# EasyEDA Pro project Telemetrie v1.eprj

# Schematic Schematic1
Board Name: Telemetrie v1; Create Date: 2026-01-04; Page Name: P1; Project Name: Telemetrie v1; Schematic Name: Schematic1; Update Date: 2026-01-05; Company: EasyEDA.com; Page Size: A4; Version: V1.0
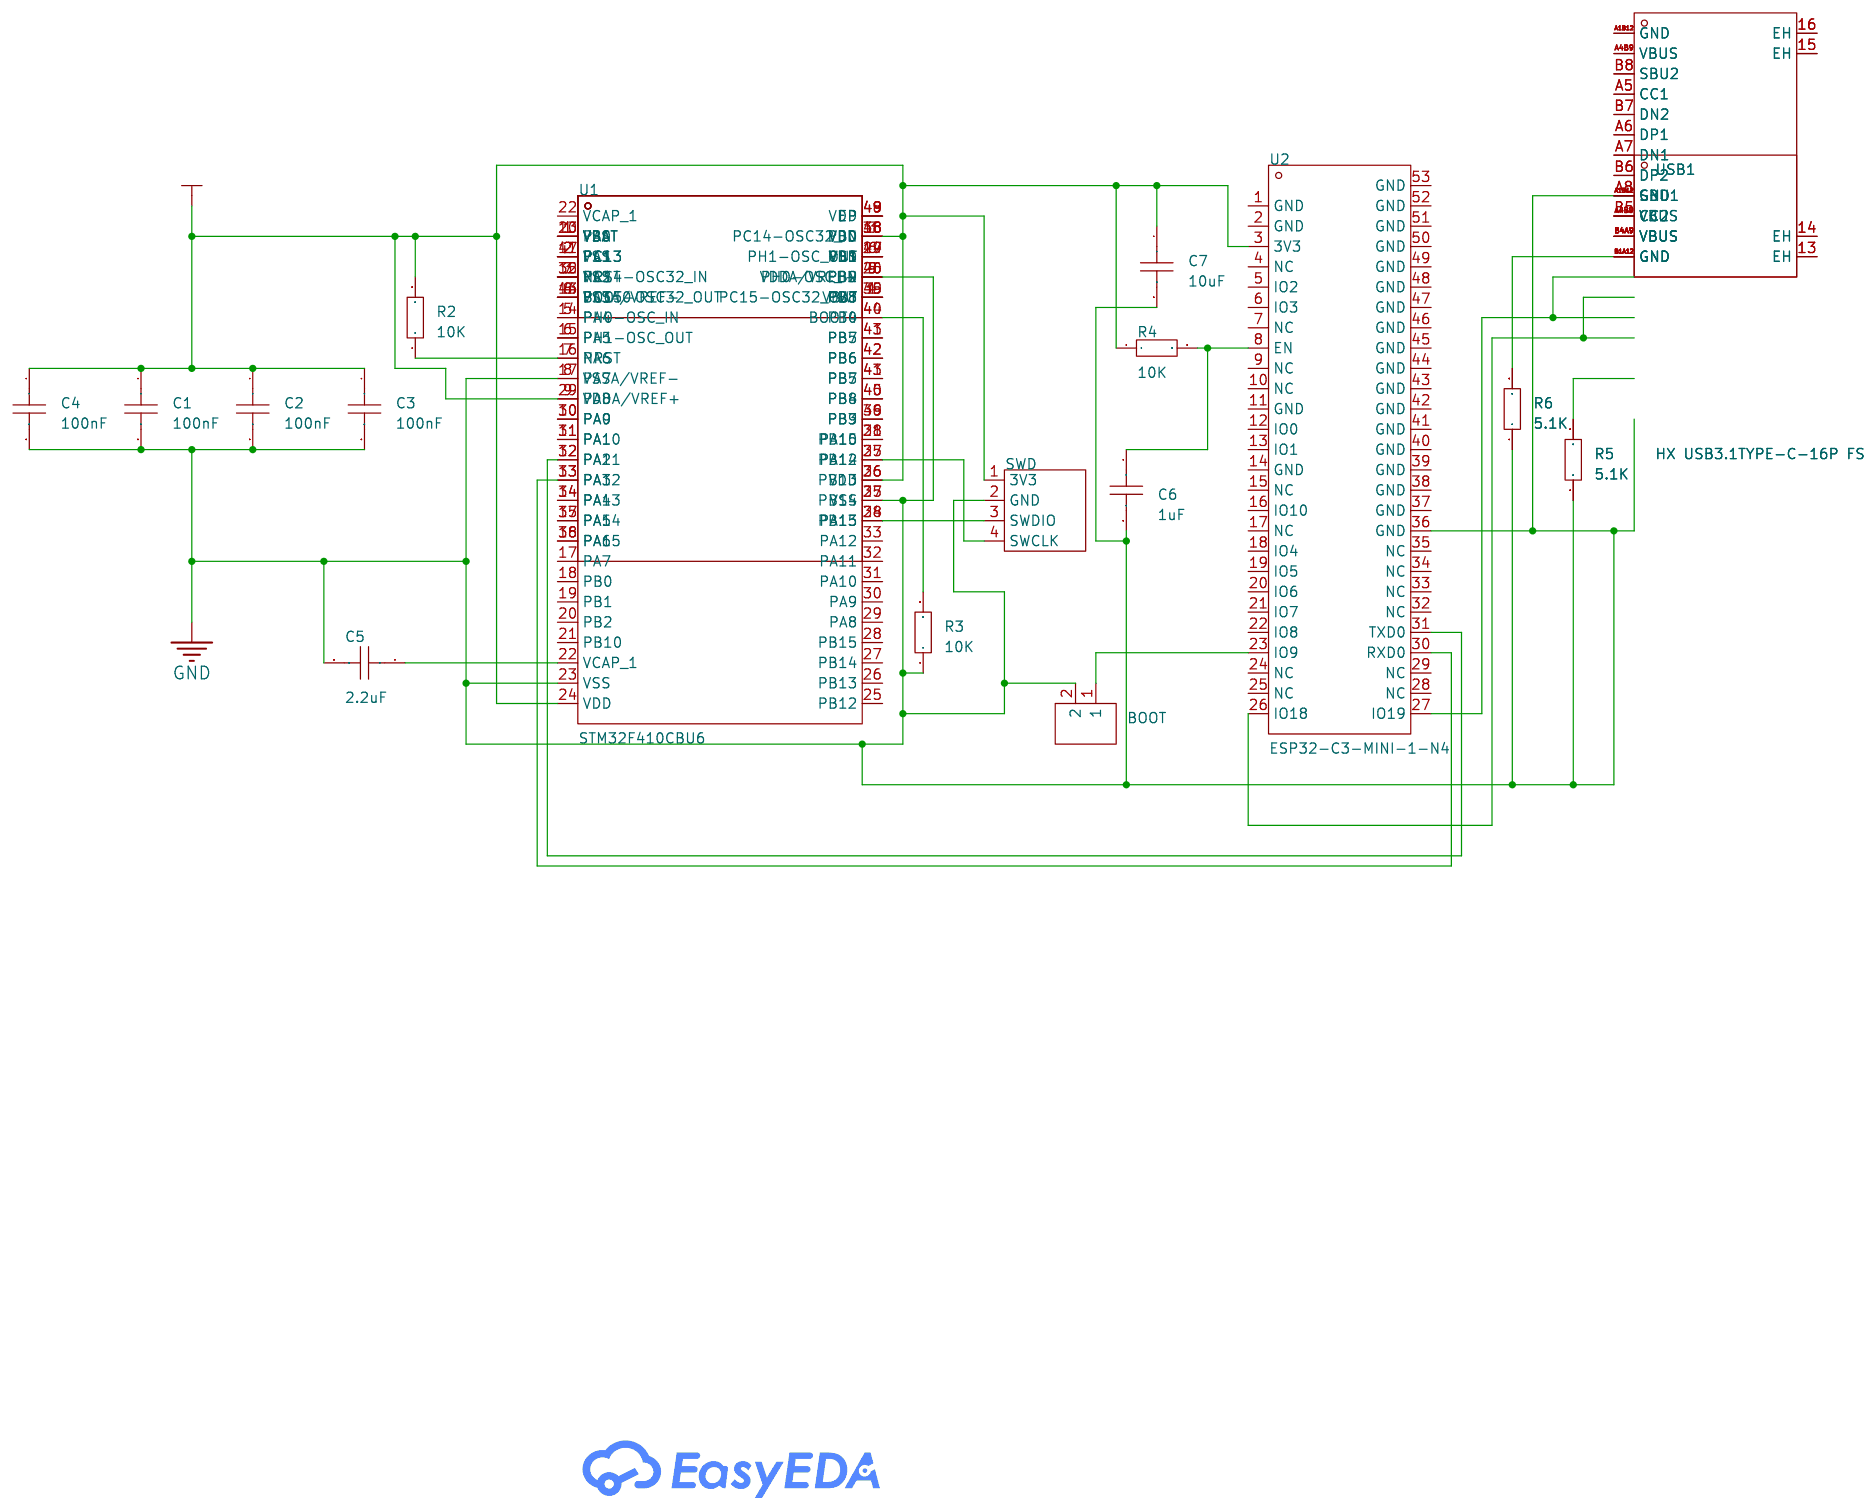
[diagram p0: schematic sheet]

## Parts
BOOT  PZ254V-11-02P  [HDR-TH_2P-P2.54-V-M]
C1  100nF  [C0603]
C2  100nF  [C0603]
C3  100nF  [C0603]
C4  100nF  [C0603]
C5  2.2uF  [C0603]
C6  1uF  [C0603]
C7  10uF  [C0603]
R2  10K  [R0603]
R3  10K  [R0603]
R4  10K  [R0603]
R5  5.1K  [R0603]
R6  5.1K  [R0603]
SWD  SWD  [HDR-TH_4P-HX-PH254-01-04-Z-L11.5]
U1  STM32F410CBU6  [UFQFPN-48_L7.0-W7.0-P0.50-BL-EP5.6]  (section 1)
U2  ESP32-C3-MINI-1-N4  [WIFIM-SMD_ESP32-C3-MINI-1]
USB1  HX USB3.1TYPE-C-16P FS  [USB-C-SMD_HX-USB3.1TYPE-C-16P-FS]  (section 1)

## Library data of the parts
BOOT = PZ254V-11-02P: LCSC Part Name: 1x2P 间距:2.54mm 方针 直插; Supplier Part: C492401; Manufacturer: XFCN(兴飞); Supplier Footprint: 插件,P=2.54mm; JLCPCB Part Class: Extended Part; Datasheet: https://item.szlcsc.com/datasheet/PZ254V-11-02P/502957.html; Supplier: LCSC; Pin Structure: 1x2P; Pitch: 2.54mm; Circluar Pins/Square Pins: Pin Header; Mounting Type: Through Hole; Number of Rows: 1; Number of Pins: 2P; Length of Mating Pin: 6mm; Insulation Height: 2.5mm; Length of End Connection Pin: 3mm; Contact Material: Brass; Operating Temperature: -40℃~+105℃; Color: Black
C1-C7 = CAP_0603: Supplier Footprint: 0603
R2-R6 = Res_0603: Supplier Footprint: 0603
SWD = HX PH254-01-04-Z-L11.5 straight pin header: Pin Structure:1x4P Pitch:2.54mm Circluar Pins/Square Pins:Pin Header Mounting Type:Through Hole Number of Rows:1 Number of Pins:4P Current Rating:3A Voltage Rating (Max):1kV Length of Mating Pin:6mm Insulation Height:2.5mm Length of End Connection Pin:3mm; LCSC Part Name: 1x4P 间距:2.54mm 方针 直插; Supplier Part: C52016392; Manufacturer: hanxia(韩下); Supplier Footprint: 插件,P=2.54mm; JLCPCB Part Class: Extended Part; Datasheet: https://item.szlcsc.com/datasheet/HX%2520PH254-01-04-Z-L11.5%2520straight%2520pin%2520header/54760437.html; Supplier: LCSC; Pin Structure: 1x4P; Pitch: 2.54mm; Circluar Pins/Square Pins: Pin Header; Mounting Type: Through Hole; Number of Rows: 1; Number of Pins: 4P; Current Rating: 3A; Voltage Rating (Max): 1kV; Length of Mating Pin: 6mm; Insulation Height: 2.5mm; Length of End Connection Pin: 3mm; Contact Material: Brass; Contact Plating: Gold; Operating Temperature: -40℃~+105℃
U1 = STM32F410CBU6: CPU Core:ARM-M4 Program Storage Size:128KB RAM Size:32KB GPIO Ports Number:36 Operating Voltage Range:1.7V~3.6V Operating Voltage Range:1.7V~3.6V CPU Maximum Speed:100MHz Program Memory Type:FLASH Operating Temperature Range:-40℃~+85℃ Operating Temperatur; LCSC Part Name: 支持BAM的STM32动态效率MCU，带DSP和FPU的高性能ARM Cortex-M4 MCU，具有128 KB Flash、100 MHz CPU和ART加速器; Supplier Part: C469221; Manufacturer: ST(意法半导体); Supplier Footprint: UFQFPN-48(7x7); JLCPCB Part Class: Extended Part; Datasheet: https://atta.szlcsc.com/upload/public/pdf/source/20191106/C443972_09E335F3AC985512E86DC3FBEA508393.pdf; Supplier: LCSC; CPU Core: ARM-M4; Program Storage Size: 128KB; RAM Size: 32KB; GPIO Ports Number: 36; Operating Voltage Range: 1.7V~3.6V; CPU Maximum Speed: 100MHz; Program Memory Type: FLASH; Operating Temperature Range: -40℃~+85℃; ADC (Bit): 12bit; DAC (Bit): 12bit; Peripheral/Function: PWM；PWM; Watchdog: Yes; Infrared Data Association: Yes; Low-Voltage Detect: Yes; Direct Memory Access: Yes; Internal Oscillator: Yes
U2 = ESP32-C3-MINI-1-N4: LCSC Part Name: 支持2.4GHz Wi-Fi和蓝牙5的小尺寸模组; Supplier Part: C2838502; Manufacturer: ESPRESSIF(乐鑫); Supplier Footprint: SMD,16.6x13.2mm; JLCPCB Part Class: Extended Part; Datasheet: https://item.szlcsc.com/datasheet/ESP32-C3-MINI-1-N4/3013227.html; Supplier: LCSC; Model: Transceiver; Output Power(Max): 20.5dBm; Interface Type: SPI；UART；I2S；I2C；USB; Voltage - Supply: 3V~3.6V; Antenna Type: On-board PCB Antenna; Receive  Current: 84mA; Send  Current: 350mA; Sensitivity: -98dBm; Operating Temperature: -40℃~+85℃
USB1 = HX USB3.1TYPE-C-16P FS: Connector Type:Type-C Protocol Standard:USB 3.1 Gender:Female Mounting Type:Surface Mount, Right Angle Number of Contacts:16P Number of Ports:1 Current Rating-Power:5A Voltage Rating:20V Connect-Disconnect Life:10,000 Cycles Supplementary Features:- Lengt; LCSC Part Name: 2件套 Type-C 母 卧贴; Supplier Part: C41427498; Manufacturer: hanxia(韩下); Supplier Footprint: SMD; JLCPCB Part Class: Extended Part; Datasheet: https://item.szlcsc.com/datasheet/HX%2520USB3.1TYPE-C-16P%2520FS/43275710.html; Supplier: LCSC; Connector Type: Type-C; Protocol Standard: USB 3.1; Gender: Female; Mounting Type: Surface Mount, Right Angle; Number of Contacts: 16P; Number of Ports: 1; Current Rating-Power: 5A; Voltage Rating: 20V; Connect-Disconnect Life: 10,000 Cycles; Length: 7.05mm; Detection color: Black; Operating Temperature: -30℃~+80℃

## Nets
3V3: C1.1 C2.1 C3.1 C4.1 C7.1 R2.2 R4.1 SWD.1(3V3) U1.9(VDDA/VREF+) U1.24(VDD) U1.36(VDD) U1.48(VDD) U2.3(3V3)
GND: BOOT.2 C1.2 C2.2 C3.2 C4.2 C5.2 C6.2 C7.2 R3.1 R5.1 R6.1 SWD.2(GND) U1.8(VSSA/VREF-) U1.23(VSS) U1.35(VSS) U1.46(PB9) U2.36(GND) USB1.A8(SBU1)
$1N1102: R3.2 U1.44(BOOT0)
$1N1108: C5.1 U1.22(VCAP_1)
$1N2104: SWD.4(SWCLK) U1.37(PA14)
$1N2110: SWD.3(SWDIO) U1.34(PA13)
$1N2329: R2.1 U1.7(NRST)
$1N3000: C6.1 R4.2 U2.8(EN)
$1N3874: U1.12(PA2) U2.31(TXD0)
$1N3927: U1.13(PA3) U2.30(RXD0)
$1N4055: BOOT.1 U2.23(IO9)
Net-(R6-2): R6.2 USB1.B1A12(GND)

Not connected (* = marked no-connect by the designer): R5 2; U1 1(VBAT) 2(PC13) 3(PC14-OSC32_IN) 4(PC15-OSC32_OUT) 5(PH0-OSC_IN) 6(PH1-OSC_OUT) 10(PA0) 11(PA1) 14(PA4) 15(PA5) 16(PA6) 17(PA7) 18(PB0) 19(PB1) 20(PB2) 21(PB10) 25(PB12) 26(PB13) 27(PB14) 28(PB15) 29(PA8) 30(PA9) 31(PA10) 32(PA11) 33(PA12) 38(PA15) 39(PB3) 40(PB4) 41(PB5) 42(PB6) 43(PB7) 45(PB8) 47(VSS) 49(EP); U2 1(GND) 2(GND) 4(NC) 5(IO2) 6(IO3) 7(NC) 9(NC) 10(NC) 11(GND) 12(IO0) 13(IO1) 14(GND) 15(NC) 16(IO10) 17(NC) 18(IO4) 19(IO5) 20(IO6) 21(IO7) 22(IO8) 24(NC) 25(NC) 26(IO18) 27(IO19) 28(NC) 29(NC) 32(NC) 33(NC) 34(NC) 35(NC) 37(GND) 38(GND) 39(GND) 40(GND) 41(GND) 42(GND) 43(GND) 44(GND) 45(GND) 46(GND) 47(GND) 48(GND) 49(GND) 50(GND) 51(GND) 52(GND) 53(GND); USB1 13(EH) 14(EH) 15(EH) 16(EH) A1B12(GND) A4B9(VBUS) A5(CC1) A6(DP1) A7(DN1) B4A9(VBUS) B5(CC2) B6(DP2) B7(DN2) B8(SBU2)

# Schematic Schematic2
Board Name: Telemetrie v2; Create Date: 2026-01-05; Page Name: P1; Project Name: Telemetrie v1; Schematic Name: Schematic2; Update Date: 2026-01-05; Company: EasyEDA.com; Page Size: A4; Version: V1.0
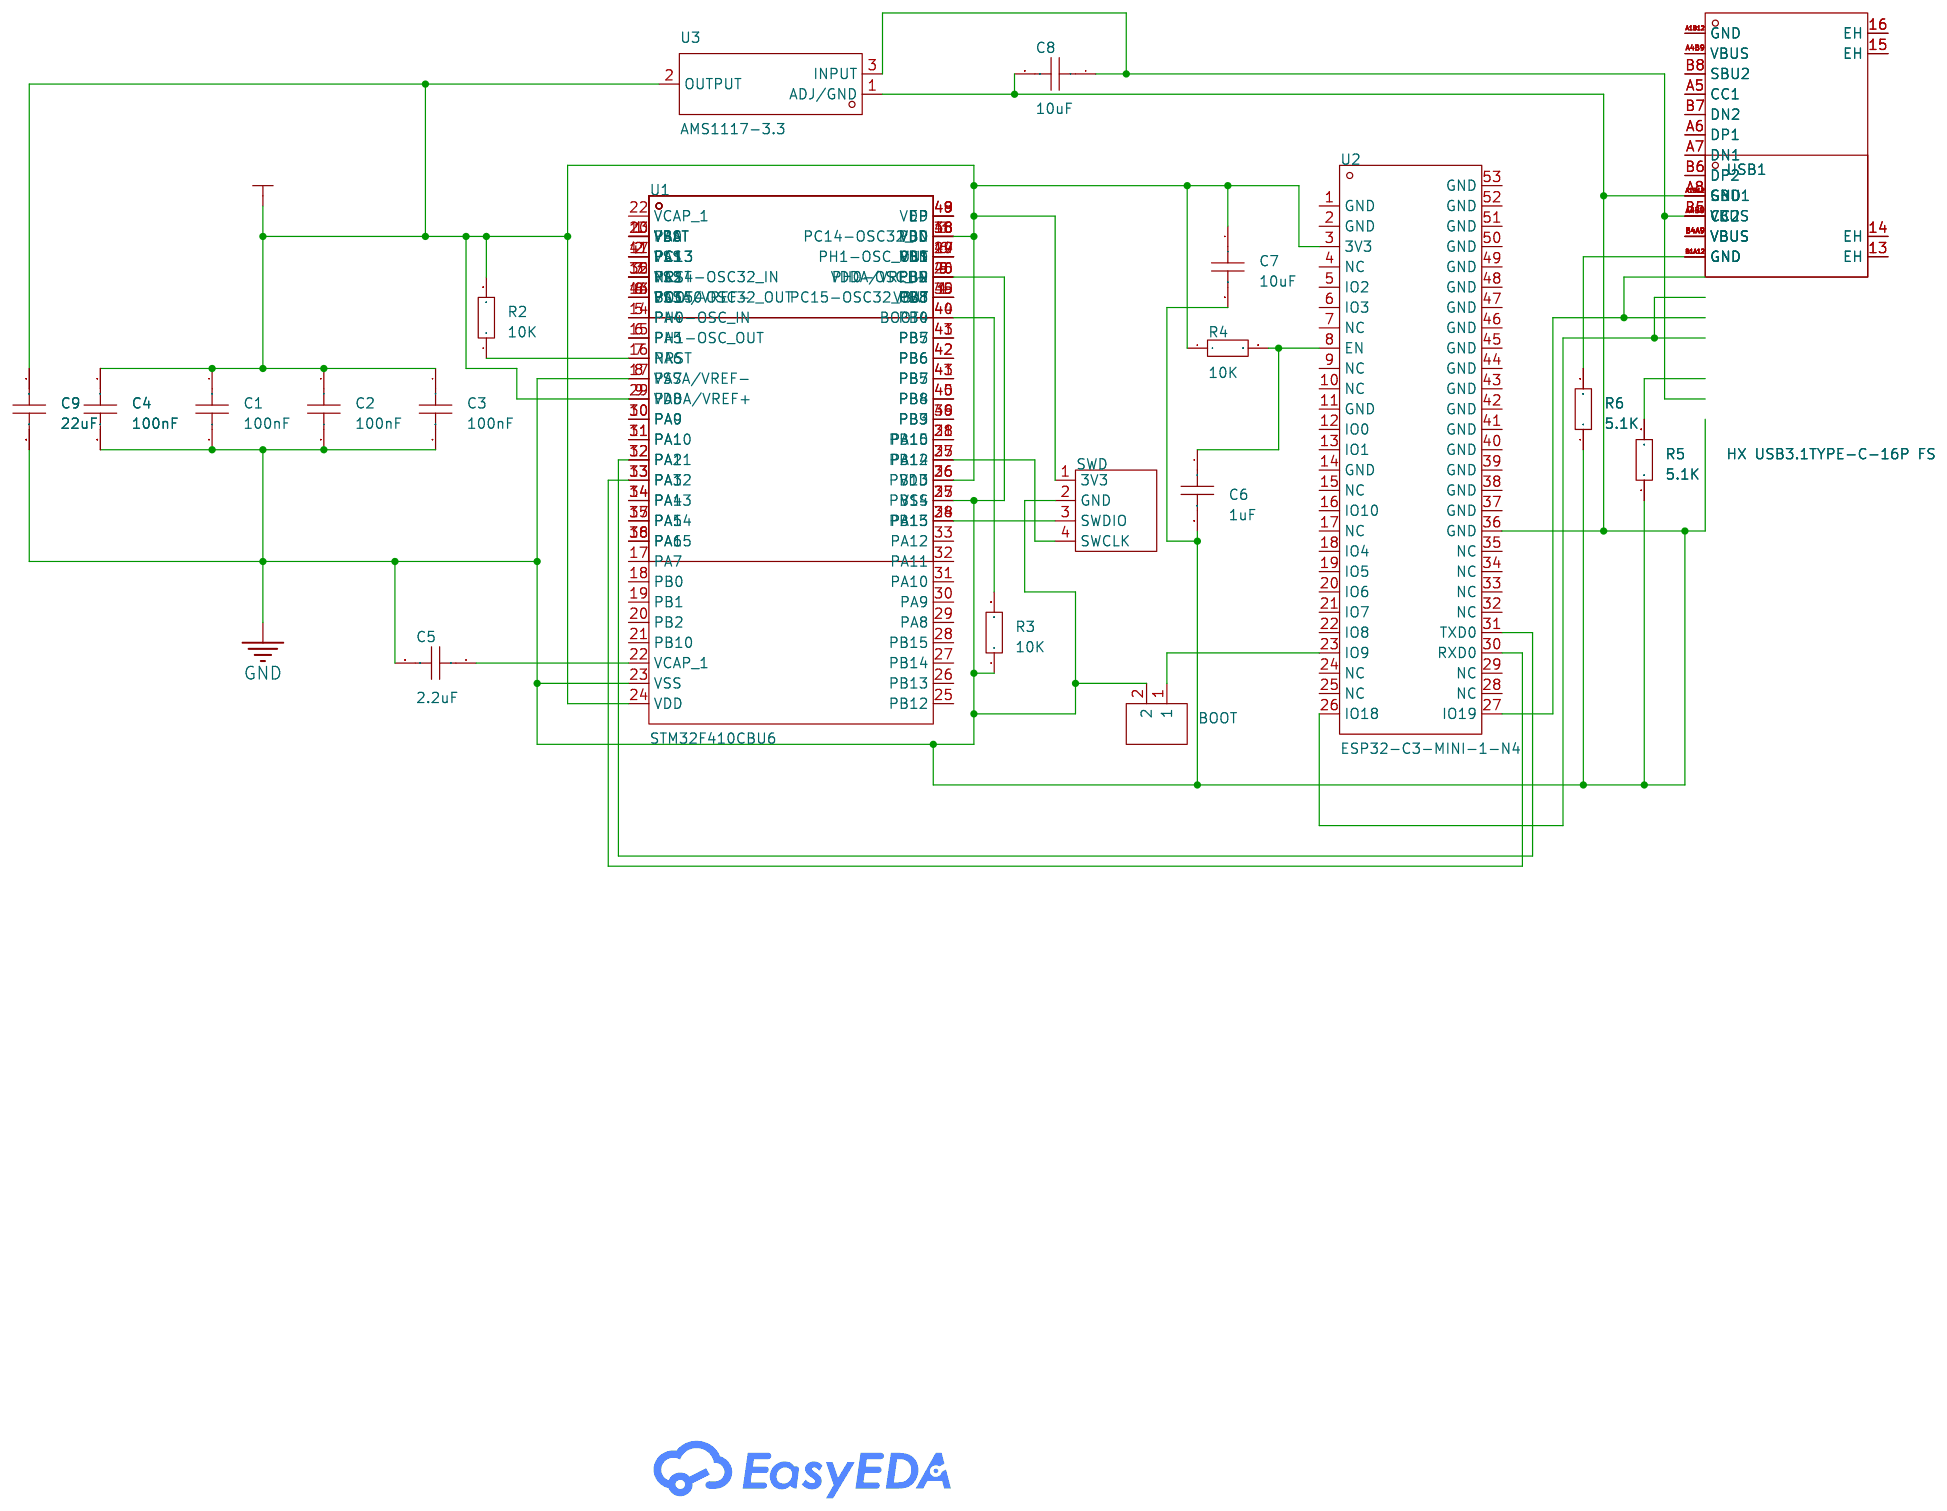
[diagram p1: schematic sheet]

## Parts
BOOT  PZ254V-11-02P  [HDR-TH_2P-P2.54-V-M]
C1  100nF  [C0603]
C2  100nF  [C0603]
C3  100nF  [C0603]
C4  100nF  [C0603]
C5  2.2uF  [C0603]
C6  1uF  [C0603]
C7  10uF  [C0603]
C8  10uF  [C0603]
C9  22uF  [C0603]
R2  10K  [R0603]
R3  10K  [R0603]
R4  10K  [R0603]
R5  5.1K  [R0603]
R6  5.1K  [R0603]
SWD  SWD  [HDR-TH_4P-HX-PH254-01-04-Z-L11.5]
U1  STM32F410CBU6  [UFQFPN-48_L7.0-W7.0-P0.50-BL-EP5.6]  (section 1)
U2  ESP32-C3-MINI-1-N4  [WIFIM-SMD_ESP32-C3-MINI-1]
U3  AMS1117-3.3  [TO-252-2_L6.6-W5.6-P2.3-LS9.7]
USB1  HX USB3.1TYPE-C-16P FS  [USB-C-SMD_HX-USB3.1TYPE-C-16P-FS]  (section 1)

## Library data of the parts
BOOT = PZ254V-11-02P: LCSC Part Name: 1x2P 间距:2.54mm 方针 直插; Supplier Part: C492401; Manufacturer: XFCN(兴飞); Supplier Footprint: 插件,P=2.54mm; JLCPCB Part Class: Extended Part; Datasheet: https://item.szlcsc.com/datasheet/PZ254V-11-02P/502957.html; Supplier: LCSC; Pin Structure: 1x2P; Pitch: 2.54mm; Circluar Pins/Square Pins: Pin Header; Mounting Type: Through Hole; Number of Rows: 1; Number of Pins: 2P; Length of Mating Pin: 6mm; Insulation Height: 2.5mm; Length of End Connection Pin: 3mm; Contact Material: Brass; Operating Temperature: -40℃~+105℃; Color: Black
C1-C9 = CAP_0603: Supplier Footprint: 0603
R2-R6 = Res_0603: Supplier Footprint: 0603
SWD = HX PH254-01-04-Z-L11.5 straight pin header: Pin Structure:1x4P Pitch:2.54mm Circluar Pins/Square Pins:Pin Header Mounting Type:Through Hole Number of Rows:1 Number of Pins:4P Current Rating:3A Voltage Rating (Max):1kV Length of Mating Pin:6mm Insulation Height:2.5mm Length of End Connection Pin:3mm; LCSC Part Name: 1x4P 间距:2.54mm 方针 直插; Supplier Part: C52016392; Manufacturer: hanxia(韩下); Supplier Footprint: 插件,P=2.54mm; JLCPCB Part Class: Extended Part; Datasheet: https://item.szlcsc.com/datasheet/HX%2520PH254-01-04-Z-L11.5%2520straight%2520pin%2520header/54760437.html; Supplier: LCSC; Pin Structure: 1x4P; Pitch: 2.54mm; Circluar Pins/Square Pins: Pin Header; Mounting Type: Through Hole; Number of Rows: 1; Number of Pins: 4P; Current Rating: 3A; Voltage Rating (Max): 1kV; Length of Mating Pin: 6mm; Insulation Height: 2.5mm; Length of End Connection Pin: 3mm; Contact Material: Brass; Contact Plating: Gold; Operating Temperature: -40℃~+105℃
U1 = STM32F410CBU6: CPU Core:ARM-M4 Program Storage Size:128KB RAM Size:32KB GPIO Ports Number:36 Operating Voltage Range:1.7V~3.6V Operating Voltage Range:1.7V~3.6V CPU Maximum Speed:100MHz Program Memory Type:FLASH Operating Temperature Range:-40℃~+85℃ Operating Temperatur; LCSC Part Name: 支持BAM的STM32动态效率MCU，带DSP和FPU的高性能ARM Cortex-M4 MCU，具有128 KB Flash、100 MHz CPU和ART加速器; Supplier Part: C469221; Manufacturer: ST(意法半导体); Supplier Footprint: UFQFPN-48(7x7); JLCPCB Part Class: Extended Part; Datasheet: https://atta.szlcsc.com/upload/public/pdf/source/20191106/C443972_09E335F3AC985512E86DC3FBEA508393.pdf; Supplier: LCSC; CPU Core: ARM-M4; Program Storage Size: 128KB; RAM Size: 32KB; GPIO Ports Number: 36; Operating Voltage Range: 1.7V~3.6V; CPU Maximum Speed: 100MHz; Program Memory Type: FLASH; Operating Temperature Range: -40℃~+85℃; ADC (Bit): 12bit; DAC (Bit): 12bit; Peripheral/Function: PWM；PWM; Watchdog: Yes; Infrared Data Association: Yes; Low-Voltage Detect: Yes; Direct Memory Access: Yes; Internal Oscillator: Yes
U2 = ESP32-C3-MINI-1-N4: LCSC Part Name: 支持2.4GHz Wi-Fi和蓝牙5的小尺寸模组; Supplier Part: FF; Manufacturer: ESPRESSIF(乐鑫); Supplier Footprint: SMD,16.6x13.2mm; JLCPCB Part Class: Extended Part; Datasheet: https://item.szlcsc.com/datasheet/ESP32-C3-MINI-1-N4/3013227.html; Supplier: LCSC; Model: Transceiver; Output Power(Max): 20.5dBm; Interface Type: SPI；UART；I2S；I2C；USB; Voltage - Supply: 3V~3.6V; Antenna Type: On-board PCB Antenna; Receive  Current: 84mA; Send  Current: 350mA; Sensitivity: -98dBm; Operating Temperature: -40℃~+85℃
U3 = AMS1117-3.3_C41414107: Supplier Part: C41414107; Manufacturer: YONGYUTAI(永裕泰); Supplier Footprint: TO-252; JLCPCB Part Class: Extended Part; Datasheet: https://item.szlcsc.com/datasheet/AMS1117-3.3/43231650.html; Supplier: LCSC; Output Type: Fixed; Voltage - Supply: 15V; Output Voltage: 3.3V; Output Current: 800mA; Power Supply Rejection Ratio (PSRR): 75dB@(120Hz); Voltage Dropout: 1.25V@(1A); Noise: 0.003%Vout; Features: Over Current Protection；Over Temperature Protection; Operating Temperature: -40℃~+125℃@(TJ); Output Configuration: Positive; Number of Outputs: 1
USB1 = HX USB3.1TYPE-C-16P FS: Connector Type:Type-C Protocol Standard:USB 3.1 Gender:Female Mounting Type:Surface Mount, Right Angle Number of Contacts:16P Number of Ports:1 Current Rating-Power:5A Voltage Rating:20V Connect-Disconnect Life:10,000 Cycles Supplementary Features:- Lengt; LCSC Part Name: 2件套 Type-C 母 卧贴; Supplier Part: C41427498; Manufacturer: hanxia(韩下); Supplier Footprint: SMD; JLCPCB Part Class: Extended Part; Datasheet: https://item.szlcsc.com/datasheet/HX%2520USB3.1TYPE-C-16P%2520FS/43275710.html; Supplier: LCSC; Connector Type: Type-C; Protocol Standard: USB 3.1; Gender: Female; Mounting Type: Surface Mount, Right Angle; Number of Contacts: 16P; Number of Ports: 1; Current Rating-Power: 5A; Voltage Rating: 20V; Connect-Disconnect Life: 10,000 Cycles; Length: 7.05mm; Detection color: Black; Operating Temperature: -30℃~+80℃

## Nets
3V3: C1.1 C2.1 C3.1 C4.1 C7.1 C9.1 R2.2 R4.1 SWD.1(3V3) U1.9(VDDA/VREF+) U1.24(VDD) U1.36(VDD) U1.48(VDD) U2.3(3V3) U3.2(OUTPUT)
GND: BOOT.2 C1.2 C2.2 C3.2 C4.2 C5.2 C6.2 C7.2 C8.2 C9.2 R3.1 R5.1 R6.1 SWD.2(GND) U1.8(VSSA/VREF-) U1.23(VSS) U1.35(VSS) U1.46(PB9) U2.36(GND) U3.1(ADJ/GND) USB1.A8(SBU1)
$1N1102: R3.2 U1.44(BOOT0)
$1N1108: C5.1 U1.22(VCAP_1)
$1N2104: SWD.4(SWCLK) U1.37(PA14)
$1N2110: SWD.3(SWDIO) U1.34(PA13)
$1N2329: R2.1 U1.7(NRST)
$1N3000: C6.1 R4.2 U2.8(EN)
$1N3874: U1.12(PA2) U2.31(TXD0)
$1N3927: U1.13(PA3) U2.30(RXD0)
$1N4055: BOOT.1 U2.23(IO9)
Net-(C8-1): C8.1 U3.3(INPUT) USB1.B5(CC2)
Net-(R6-2): R6.2 USB1.B1A12(GND)

Not connected (* = marked no-connect by the designer): R5 2; U1 1(VBAT) 2(PC13) 3(PC14-OSC32_IN) 4(PC15-OSC32_OUT) 5(PH0-OSC_IN) 6(PH1-OSC_OUT) 10(PA0) 11(PA1) 14(PA4) 15(PA5) 16(PA6) 17(PA7) 18(PB0) 19(PB1) 20(PB2) 21(PB10) 25(PB12) 26(PB13) 27(PB14) 28(PB15) 29(PA8) 30(PA9) 31(PA10) 32(PA11) 33(PA12) 38(PA15) 39(PB3) 40(PB4) 41(PB5) 42(PB6) 43(PB7) 45(PB8) 47(VSS) 49(EP); U2 1(GND) 2(GND) 4(NC) 5(IO2) 6(IO3) 7(NC) 9(NC) 10(NC) 11(GND) 12(IO0) 13(IO1) 14(GND) 15(NC) 16(IO10) 17(NC) 18(IO4) 19(IO5) 20(IO6) 21(IO7) 22(IO8) 24(NC) 25(NC) 26(IO18) 27(IO19) 28(NC) 29(NC) 32(NC) 33(NC) 34(NC) 35(NC) 37(GND) 38(GND) 39(GND) 40(GND) 41(GND) 42(GND) 43(GND) 44(GND) 45(GND) 46(GND) 47(GND) 48(GND) 49(GND) 50(GND) 51(GND) 52(GND) 53(GND); USB1 13(EH) 14(EH) 15(EH) 16(EH) A1B12(GND) A4B9(VBUS) A5(CC1) A6(DP1) A7(DN1) B4A9(VBUS) B6(DP2) B7(DN2) B8(SBU2)

# Schematic Schematic3

## Sheets
1 Power: Board Name: Telemetrie v3; Create Date: 2026-01-05; Page Name: Power; Project Name: Telemetrie v1; Schematic Name: Schematic3; Update Date: 2026-01-12; Company: EasyEDA.com; Page Size: A4; Version: V1.0
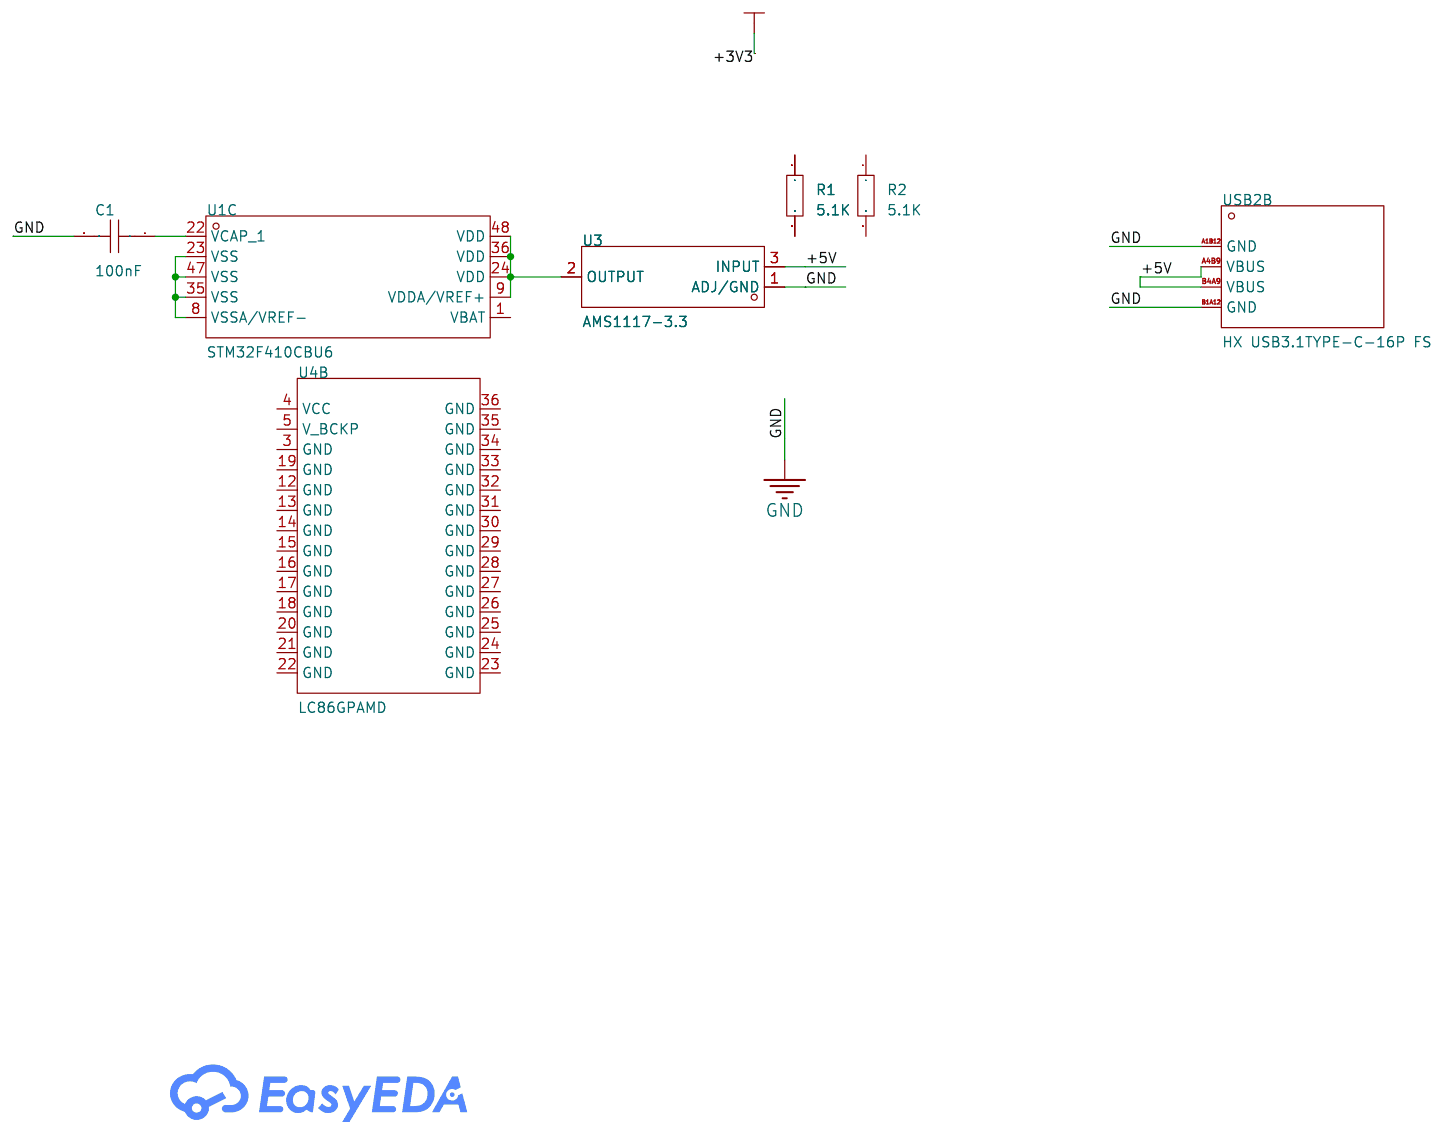
[diagram p2: Power]
2 usb: Page Name: P1; Project Name: Project Name; Schematic Name: Schematic Name; Update Date: 2021.11.05
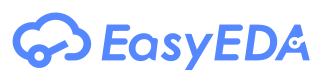
[diagram p3: usb]
3 Sensors: Page Name: P1; Project Name: Project Name; Schematic Name: Schematic Name; Update Date: 2021.11.05
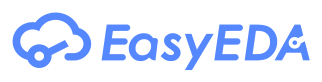
[diagram p4: Sensors]

## Parts
C1  100nF  [C0603]
R1  5.1K  [R0603]
R2  5.1K  [R0603]
U1  STM32F410CBU6  [UFQFPN-48_L7.0-W7.0-P0.50-BL-EP5.6]  (section Power)
U3  AMS1117-3.3  [TO-252-2_L6.6-W5.6-P2.3-LS9.7]
U4  LC86GPAMD  [GPSM-SMD_L18.4-W18.4-P2.54_LC86GLAMD]  (section Power)
USB2  HX USB3.1TYPE-C-16P FS  [USB-C-SMD_HX-USB3.1TYPE-C-16P-FS]  (section 1)

## Library data of the parts
C1 = CAP_0603: Supplier Footprint: 0603
R1 R2 = Res_0603: Supplier Footprint: 0603
U1 = STM32F410CBU6: CPU Core:ARM-M4 Program Storage Size:128KB RAM Size:32KB GPIO Ports Number:36 Operating Voltage Range:1.7V~3.6V Operating Voltage Range:1.7V~3.6V CPU Maximum Speed:100MHz Program Memory Type:FLASH Operating Temperature Range:-40℃~+85℃ Operating Temperatur; LCSC Part Name: 支持BAM的STM32动态效率MCU，带DSP和FPU的高性能ARM Cortex-M4 MCU，具有128 KB Flash、100 MHz CPU和ART加速器; Supplier Part: C469221; Manufacturer: ST(意法半导体); Supplier Footprint: UFQFPN-48(7x7); JLCPCB Part Class: Extended Part; Datasheet: https://atta.szlcsc.com/upload/public/pdf/source/20191106/C443972_09E335F3AC985512E86DC3FBEA508393.pdf; Supplier: LCSC; CPU Core: ARM-M4; Program Storage Size: 128KB; RAM Size: 32KB; GPIO Ports Number: 36; Operating Voltage Range: 1.7V~3.6V; CPU Maximum Speed: 100MHz; Program Memory Type: FLASH; Operating Temperature Range: -40℃~+85℃; ADC (Bit): 12bit; DAC (Bit): 12bit; Peripheral/Function: PWM；PWM; Watchdog: Yes; Infrared Data Association: Yes; Low-Voltage Detect: Yes; Direct Memory Access: Yes; Internal Oscillator: Yes
U3 = AMS1117-3.3_C41414107: Supplier Part: C41414107; Manufacturer: YONGYUTAI(永裕泰); Supplier Footprint: TO-252; JLCPCB Part Class: Extended Part; Datasheet: https://item.szlcsc.com/datasheet/AMS1117-3.3/43231650.html; Supplier: LCSC; Output Type: Fixed; Voltage - Supply: 15V; Output Voltage: 3.3V; Output Current: 800mA; Power Supply Rejection Ratio (PSRR): 75dB@(120Hz); Voltage Dropout: 1.25V@(1A); Noise: 0.003%Vout; Features: Over Current Protection；Over Temperature Protection; Operating Temperature: -40℃~+125℃@(TJ); Output Configuration: Positive; Number of Outputs: 1
U4 = LC86GPAMD: Supplier Part: C21779138; Manufacturer: Quectel(移远); Datasheet: https://item.szlcsc.com/datasheet/LC86GPAMD/23206398.html; Supplier: LCSC
USB2 = HX USB3.1TYPE-C-16P FS: Connector Type:Type-C Protocol Standard:USB 3.1 Gender:Female Mounting Type:Surface Mount, Right Angle Number of Contacts:16P Number of Ports:1 Current Rating-Power:5A Voltage Rating:20V Connect-Disconnect Life:10,000 Cycles Supplementary Features:- Lengt; LCSC Part Name: 2件套 Type-C 母 卧贴; Supplier Part: C41427498; Manufacturer: hanxia(韩下); Supplier Footprint: SMD; JLCPCB Part Class: Extended Part; Datasheet: https://item.szlcsc.com/datasheet/HX%2520USB3.1TYPE-C-16P%2520FS/43275710.html; Supplier: LCSC; Connector Type: Type-C; Protocol Standard: USB 3.1; Gender: Female; Mounting Type: Surface Mount, Right Angle; Number of Contacts: 16P; Number of Ports: 1; Current Rating-Power: 5A; Voltage Rating: 20V; Connect-Disconnect Life: 10,000 Cycles; Length: 7.05mm; Detection color: Black; Operating Temperature: -30℃~+80℃

## Nets
+5V: U3.3(INPUT) USB2.A4B9(VBUS) USB2.B4A9(VBUS)
GND: C1.2 U3.1(ADJ/GND) USB2.A1B12(GND) USB2.B1A12(GND)
Net-(C1-1): C1.1 U1.22(VCAP_1)
Net-(U1-8): U1.8(VSSA/VREF-) U1.23(VSS) U1.35(VSS) U1.47(VSS)
Net-(U1-9): U1.9(VDDA/VREF+) U1.24(VDD) U1.36(VDD) U1.48(VDD) U3.2(OUTPUT)

Not connected (* = marked no-connect by the designer): R1 1 2; R2 1 2; U1 1(VBAT); U4 3(GND) 4(VCC) 5(V_BCKP) 12(GND) 13(GND) 14(GND) 15(GND) 16(GND) 17(GND) 18(GND) 19(GND) 20(GND) 21(GND) 22(GND) 23(GND) 24(GND) 25(GND) 26(GND) 27(GND) 28(GND) 29(GND) 30(GND) 31(GND) 32(GND) 33(GND) 34(GND) 35(GND) 36(GND)

# Board PCB1
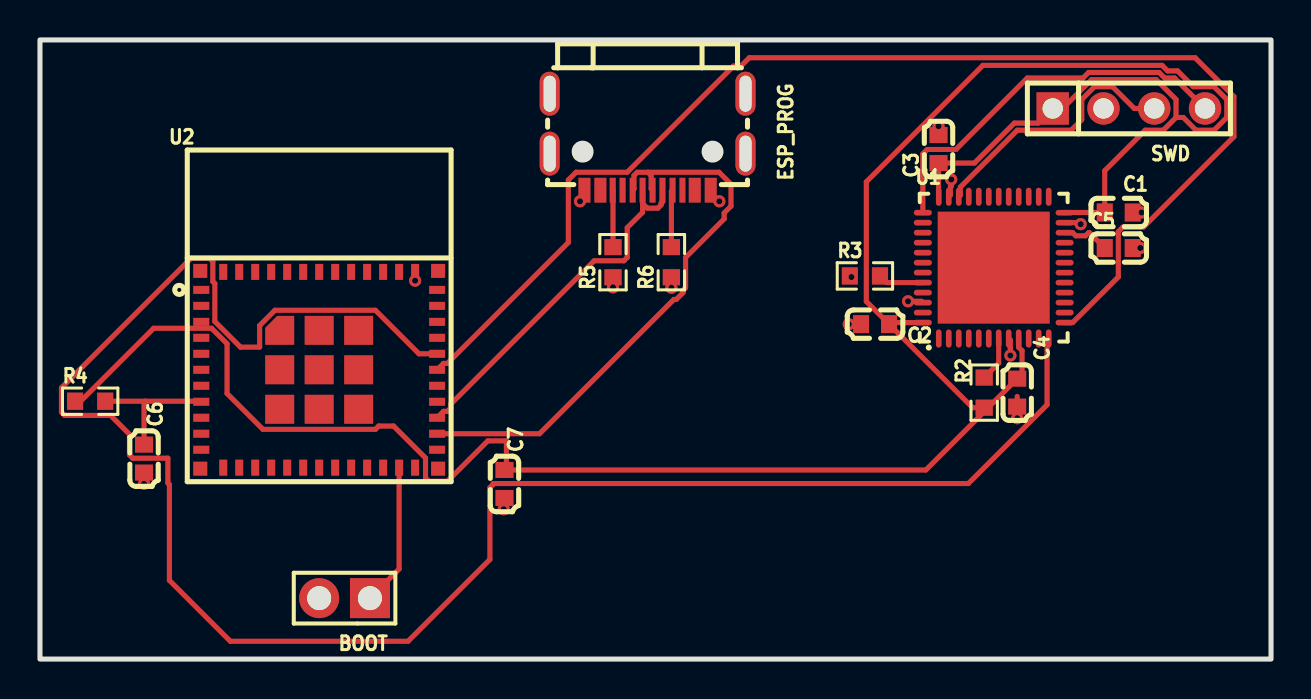
[diagram p5: board, top side]
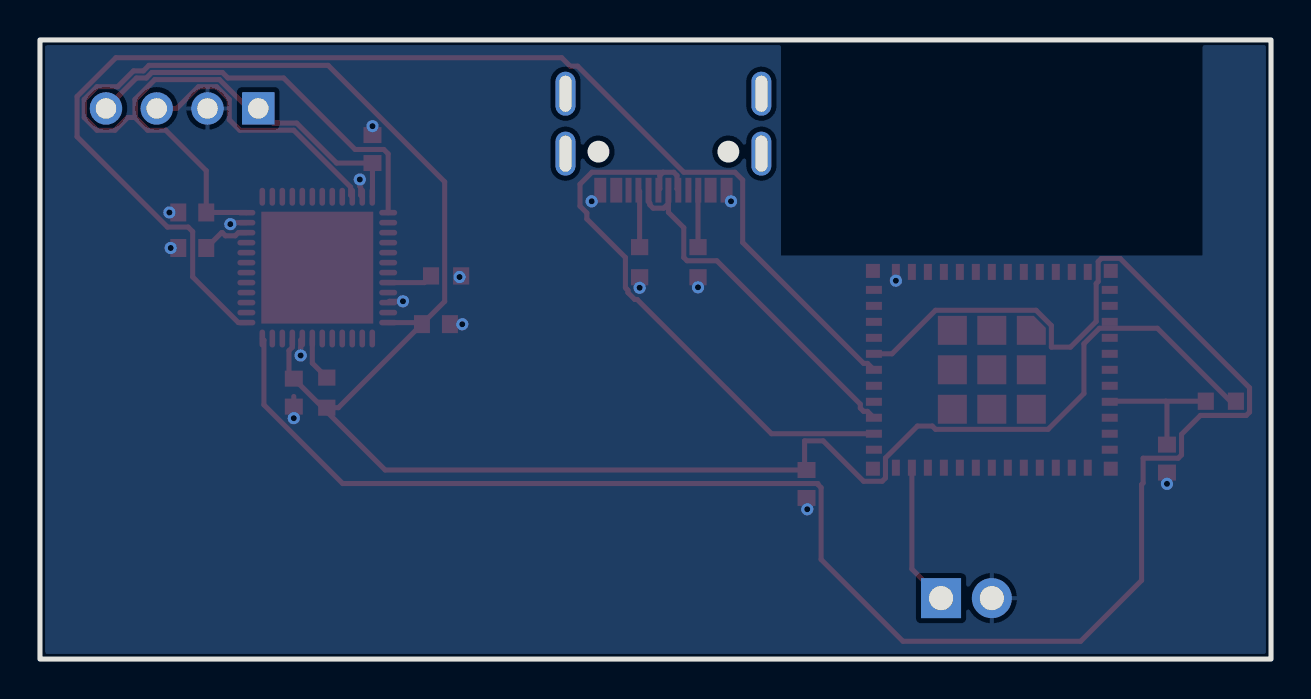
[diagram p6: board, bottom side, seen from below]

Outline 61.59 x 30.99 mm; copper layers: Top Layer, Bottom Layer. Coordinates in mm from the lower left corner of the outline.
Outline path: rectangle 0,30.99 61.59,0
Stack: Top Layer 0.035mm / Dielectric1 1.51mm FR4 er 4.5 / Bottom Layer 0.035mm

## Design rules (mm)
template: JLCPCB Capability(Two Layers Board)
spacing copperThickness1oz (default): track to track 0.102, other pairs 0.152 to 0.3
spacing copperThickness2oz: track to track 0.203, other pairs 0.152 to 0.3
track width copperThickness1oz (default): min 0.127, default 0.254, max 2.54
track width copperThickness2oz: min 0.203, default 0.254, max 2.54
differential pair differentialPair (default): width min 0.127, default 0.254, max 2.54; gap min 0.152, default 0.152
via viaSize (default): diameter min 0.5, default 0.61, max 10; hole min 0.3, default 0.305, max 6.3

## Placement (name value [footprint] x y rotation side)
BOOT  PZ254V-11-02P  [HDR-TH_2P-P2.54-V-M]  15.24 3.05 180 top
C1  100nF  [C0603]  53.97 22.35 0 top
C2  100nF  [C0603]  41.78 16.76 180 top
C3  100nF  [C0603]  44.96 25.53 90 top
C4  100nF  [C0603]  48.9 13.34 270 top
C5  2.2uF  [C0603]  53.97 20.57 0 top
C6  1uF  [C0603]  5.21 10.03 270 top
C7  10uF  [C0603]  23.24 8.76 270 top
ESP_PROG  HX USB3.1TYPE-C-16P FS  [USB-C-SMD_HX-USB3.1TYPE-C-16P-FS]  30.4 25.88 180 top
R2  10K  [R0603]  47.24 13.34 270 top
R3  10K  [R0603]  41.28 19.18 0 top
R4  10K  [R0603]  2.51 12.91 0 top
R5  5.1K  [R0603]  28.67 19.86 90 top
R6  5.1K  [R0603]  31.59 19.86 90 top
SWD  SWD  [HDR-TH_4P-HX-PH254-01-04-Z-L11.5]  54.48 27.56 0 top
U1  STM32F410CBU6  [UFQFPN-48_L7.0-W7.0-P0.50-BL-EP5.6]  47.72 19.59 0 top
U2  ESP32-C3-MINI-1-N4  [WIFIM-SMD_ESP32-C3-MINI-1]  13.97 14.48 0 top

## Footprints (pads in the part's own frame, mm; a bottom-side part is the same pattern mirrored in y, then rotated)
C0603
  rect 0.8x0.9 smd: 1(-0.7,0) 2(0.7,0)
HDR-TH_2P-P2.54-V-M
  rect 2x2 hole 1.2: 1(-1.27,0)
  round 2 hole 1.2: 2(1.27,0)
HDR-TH_4P-HX-PH254-01-04-Z-L11.5
  rect 1.62x1.62 hole 1.02: 1(-3.81,0)
  round 1.62 hole 1.02: 2(-1.27,0) 3(1.27,0) 4(3.81,0)
R0603
  rect 0.806x0.864 smd: 1(-0.753,0) 2(0.753,0)
UFQFPN-48_L7.0-W7.0-P0.50-BL-EP5.6
  oval 0.28x0.9 smd: 1(-2.751,-3.547) 2(-2.251,-3.547) 3(-1.75,-3.547) 4(-1.25,-3.547) 5(-0.75,-3.547) 6(-0.249,-3.547) 7(0.249,-3.547) 8(0.75,-3.547) 9(1.25,-3.547) 10(1.75,-3.547) 11(2.251,-3.547) 12(2.751,-3.547) 25(2.751,3.547) 26(2.251,3.547) 27(1.75,3.547) 28(1.25,3.547) 29(0.75,3.547) 30(0.249,3.547) 31(-0.249,3.547) 32(-0.75,3.547) 33(-1.25,3.547) 34(-1.75,3.547) 35(-2.251,3.547) 36(-2.751,3.547)
  oval 0.9x0.28 smd: 13(3.547,-2.75) 14(3.547,-2.25) 15(3.547,-1.75) 16(3.547,-1.25) 17(3.547,-0.75) 18(3.547,-0.25) 19(3.547,0.25) 20(3.547,0.75) 21(3.547,1.25) 22(3.547,1.75) 23(3.547,2.25) 24(3.547,2.75) 37(-3.547,2.751) 38(-3.547,2.251) 39(-3.547,1.75) 40(-3.547,1.25) 41(-3.547,0.75) 42(-3.547,0.249) 43(-3.547,-0.249) 44(-3.547,-0.75) 45(-3.547,-1.25) 46(-3.547,-1.75) 47(-3.547,-2.251) 48(-3.547,-2.751)
  rect 5.6x5.6 smd: 49(0,0)
USB-C-SMD_HX-USB3.1TYPE-C-16P-FS
  oval 1x2.2 hole 0.6x1.8: 13(-4.9,0.585) 14(-4.9,-2.415) 15(4.9,-2.415) 16(4.9,0.585)
  rect 0.6x1.24 smd: A1B12(-3.16,2.415) A4B9(-2.36,2.415) B1A12(3.16,2.415) B4A9(2.36,2.415)
  rect 0.3x1.24 smd: A5(-1.25,2.415) A6(-0.25,2.415) A7(0.25,2.415) A8(1.25,2.415) B5(1.745,2.415) B6(0.745,2.415) B7(-0.745,2.415) B8(-1.745,2.415)
WIFIM-SMD_ESP32-C3-MINI-1
  rect 0.8x0.4 smd: 1(-5.9,4) 2(-5.9,3.2) 3(-5.9,2.4) 4(-5.9,1.6) 5(-5.9,0.8) 6(-5.9,0) 7(-5.9,-0.8) 8(-5.9,-1.6) 9(-5.9,-2.4) 10(-5.9,-3.2) 11(-5.9,-4) 25(5.9,-4) 26(5.9,-3.2) 27(5.9,-2.4) 28(5.9,-1.6) 29(5.9,-0.8) 30(5.9,0) 31(5.9,0.8) 32(5.9,1.6) 33(5.9,2.4) 34(5.9,3.2) 35(5.9,4)
  rect 0.4x0.8 smd: 12(-4.8,-4.9) 13(-4,-4.9) 14(-3.2,-4.9) 15(-2.4,-4.9) 16(-1.6,-4.9) 17(-0.8,-4.9) 18(0,-4.9) 19(0.8,-4.9) 20(1.6,-4.9) 21(2.4,-4.9) 22(3.2,-4.9) 23(4,-4.9) 24(4.8,-4.9) 36(4.8,4.9) 37(4,4.9) 38(3.2,4.9) 39(2.4,4.9) 40(1.6,4.9) 41(0.8,4.9) 42(0,4.9) 43(-0.8,4.9) 44(-1.6,4.9) 45(-2.4,4.9) 46(-3.2,4.9) 47(-4,4.9) 48(-4.8,4.9)
  custom 1.45x1.45 smd: 49(-1.975,1.975)
  rect 1.45x1.45 smd: 49(-1.975,0) 49(-1.975,-1.975) 49(0,1.975) 49(0,0) 49(0,-1.975) 49(1.975,1.975) 49(1.975,0) 49(1.975,-1.975)
  rect 0.7x0.7 smd: 50(5.95,4.95) 51(5.95,-4.95) 52(-5.95,-4.95) 53(-5.95,4.95)

## Nets
3V3: C1.1 C2.1 C3.1 C4.1 C7.1 R2.2 R4.1 SWD.1 U1.9 U1.24 U1.36 U1.48 U2.3
GND: BOOT.2 C1.2 C2.2 C3.2 C4.2 C5.2 C6.2 C7.2 ESP_PROG.A1B12 ESP_PROG.B1A12 R3.1 R5.1 R6.1 SWD.2 U1.8 U1.23 U1.35 U1.46 U2.36
$1N1102: R3.2 U1.44
$1N1108: C5.1 U1.22
$1N2104: SWD.4 U1.37
$1N2110: SWD.3 U1.34
$1N2329: R2.1 U1.7
$1N3000: C6.1 R4.2 U2.8
$1N3531: ESP_PROG.A7 ESP_PROG.B7 U2.27
$1N3554: ESP_PROG.B5 R5.2
$1N3659: ESP_PROG.A5 R6.2
$1N3874: U1.12 U2.31
$1N3920: ESP_PROG.A6 ESP_PROG.B6 U2.26
$1N3927: U1.13 U2.30
$1N4055: BOOT.1 U2.23

Pads without a net: ESP_PROG 13 14 15 16 A4B9 A8 B4A9 B8; U1 1 2 3 4 5 6 10 11 14 15 16 17 18 19 20 21 25 26 27 28 29 30 31 32 33 38 39 40 41 42 43 45 47 49; U2 1 2 4 5 6 7 9 10 11 12 13 14 15 16 17 18 19 20 21 22 24 25 28 29 32 33 34 35 37 38 39 40 41 42 43 44 45 46 47 48 49 50 51 52 53

## Via types
v1: diameter 0.61, hole 0.305, Top Layer to Bottom Layer, 17 vias

## Routing (per net, layer and track width the routed paths; a pad name or vN(x,y) marks a point on that pad's centre or on a via; arc(x,y) is an arc through that point)
3V3: length 127
  Top Layer w0.254: 47.44,12.58 44.32,9.46 C7.1 23.34,9.56 23.34,10.92 22.41,10.92 20.39,8.9 19.45,8.9 19.29,9.06 19.29,10.06 17.69,11.66 16.95,11.66 16.79,11.5 11.15,11.5 9.36,13.29 9.36,15.78 8.59,16.56 5.69,16.56 2.03,12.91 R4.1 ; 47.44,12.58 R2.2 46.67,12.58 C2.1 ; 47.44,12.58 C4.1 49.14,14.28 49.14,15.44 48.97,15.6 U1.9 ; U1.36 44.96,23.15 C3.1 46.75,24.83 48.75,26.83 49.94,26.83 SWD.1 51.17,27.56 52.61,29 55.85,29 56.84,28.01 56.84,27.11 ; 56.84,27.11 57.2,27.11 57.84,26.47 58.74,26.47 59.38,27.11 59.38,28.01 58.74,28.65 57.71,28.65 56.92,29.44 56.42,29.44 56.14,29.72 47.18,29.72 41.35,23.89 41.35,17.9 C2.1 ; 56.84,27.11 56.2,26.47 55.3,26.47 53.28,24.44 C1.1 51.28,22.35 U1.24 ; C2.1 42.56,16.84 44.17,16.84
GND: length 3.9
  Top Layer w0.254: U1.35 45.55,23.22 45.55,23.62 45.59,23.66 v1(45.59,24) ; U1.8 48.55,15.96 48.55,15.56 48.55,15.56 v1(48.55,15.2) ; U1.23 52,21.84 v1(52.07,21.77) ; v1(43.43,17.91) 44.11,17.91 44.17,17.84 ; 48.9,13.14 C4.2
  vias: v1(5.21,8.77) v1(18.77,18.94) v1(23.21,7.5) v1(27.02,22.91) v1(28.67,18.61) v1(31.59,18.58) v1(33.99,22.91) v1(40.47,16.76) v1(40.6,19.12) v1(44.96,26.67) v1(48.9,12.06) v1(55.06,20.57) v1(55.12,22.35)
$1N1102: length 2.3
  Top Layer w0.254: R3.2 42.36,18.84 44.17,18.84
$1N1108: length 2.5
  Top Layer w0.254: C5.1 52.51,21.34 52.47,21.34 52.31,21.18 51.83,21.18 51.67,21.34 U1.22
$1N2104: length 19.5
  Top Layer w0.254: 44.17,22.34 44.17,25.29 44.39,25.51 45.83,25.51 49.4,29.08 52.19,29.08 52.47,29.36 56,29.36 56.27,29.08 56.77,29.08 SWD.4
$1N2110: length 13.3
  Top Layer w0.254: U1.34 46.05,23.22 46.05,23.62 48.9,26.47 51.6,26.47 52.12,27 52.12,28.01 52.76,28.65 53.66,28.65 54.75,27.56 SWD.3
$1N2329: length 2.3
  Top Layer w0.254: R2.1 47.97,14.81 U1.7
$1N3000: length 7
  Top Layer w0.254: R4.2 5.27,12.91 ; 5.27,12.91 5.21,12.85 C6.1 ; 5.27,12.91 8.04,12.91 8.07,12.88
$1N3531: length 18.5
  Top Layer w0.254: 30.15,22.8 30.39,22.57 30.92,22.57 31.08,22.73 31.08,22.82 31.15,22.88 ESP_PROG.B7 ; 30.15,22.8 ESP_PROG.A7 ; 30.15,22.8 30.15,22.36 29.38,21.59 29.38,20.1 29.22,19.94 27.73,19.94 20.55,12.76 20.55,12.56 20.39,12.4 20.19,12.4 U2.27
$1N3554: length 3
  Top Layer w0.254: ESP_PROG.B5 28.67,23.45 28.67,20.49
$1N3659: length 2.9
  Top Layer w0.254: R6.2 31.59,23.41 ESP_PROG.A5
$1N3874: length 97.1
  Top Layer w0.254: U1.12 50.39,15.96 50.39,12.73 46.45,8.78 22.68,8.78 22.68,8.74 22.51,8.58 22.51,4.99 18.41,0.89 9.53,0.89 6.48,3.94 6.48,8.73 6.4,8.81 6.4,10.05 4.64,10.05 4.48,10.22 4.48,11.25 3.53,12.19 1.24,12.19 1.08,12.36 1.08,13.58 7.55,20.06 8.49,20.06 8.65,19.89 8.65,18.89 8.75,18.79 8.75,16.9 10.03,15.61 10.99,15.61 10.99,16.69 11.75,17.46 16.79,17.46 18.96,15.28 U2.31
$1N3920: length 28.6
  Top Layer w0.254: U2.26 24.99,11.28 31.71,18 31.83,18 32.18,18.34 32.18,18.46 32.26,18.54 32.26,18.55 32.3,18.59 32.3,20.1 34.23,22.03 34.23,22.33 34.57,22.67 34.57,23.77 33.98,24.37 30.42,24.37 ; 30.42,24.37 29.89,24.37 29.72,24.2 29.72,23.53 ESP_PROG.B6 ; 30.42,24.37 30.58,24.2 30.58,23.54 ESP_PROG.A6
$1N3927: length 64.6
  Top Layer w0.254: U2.30 20.19,14.8 20.39,14.8 26.44,20.85 26.44,23.98 26.83,24.37 29.38,24.37 34.69,29.68 35.07,29.68 35.49,30.1 57.8,30.1 59.74,28.16 59.74,26.15 55.22,21.62 54.18,21.62 53.95,21.39 53.95,19.13 51.67,16.84 U1.13
$1N4055: length 7.1
  Top Layer w0.254: BOOT.1 17.97,4.51 U2.23

## Copper pours and planes (outline as drawn; the poured copper is in the pictures)
GND on Bottom Layer: 0.13,30.99 61.59,30.99 61.59,0 0.13,0

# Board PCB2
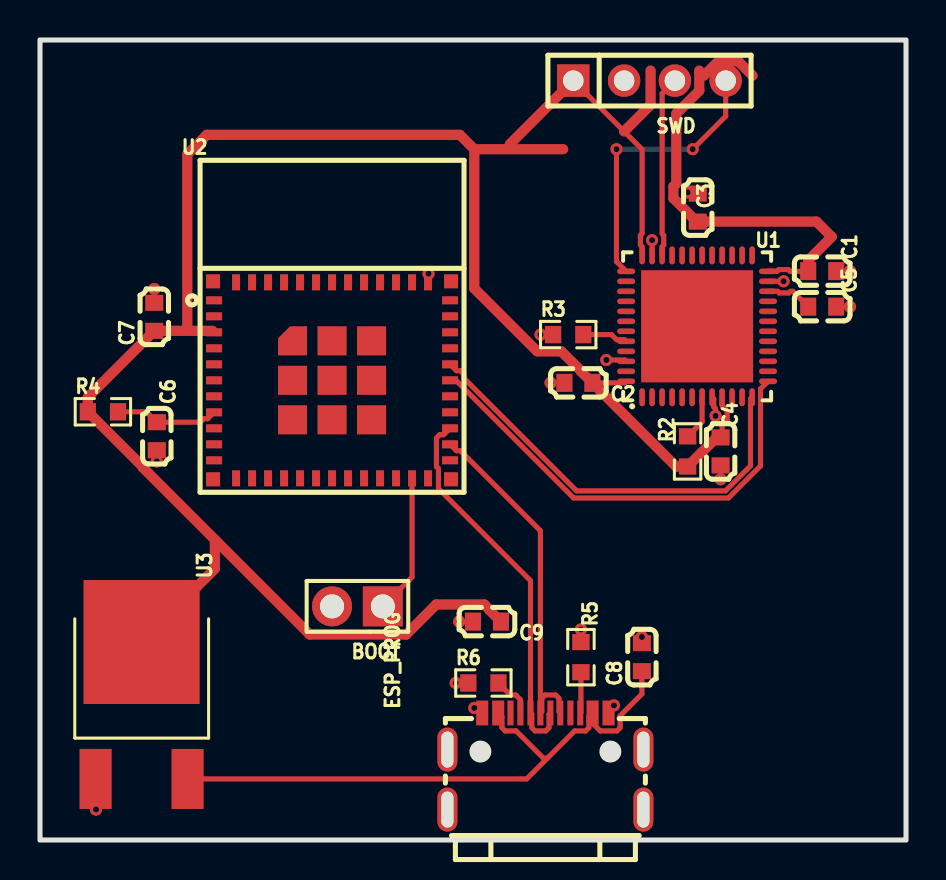
[diagram p7: board, top side]
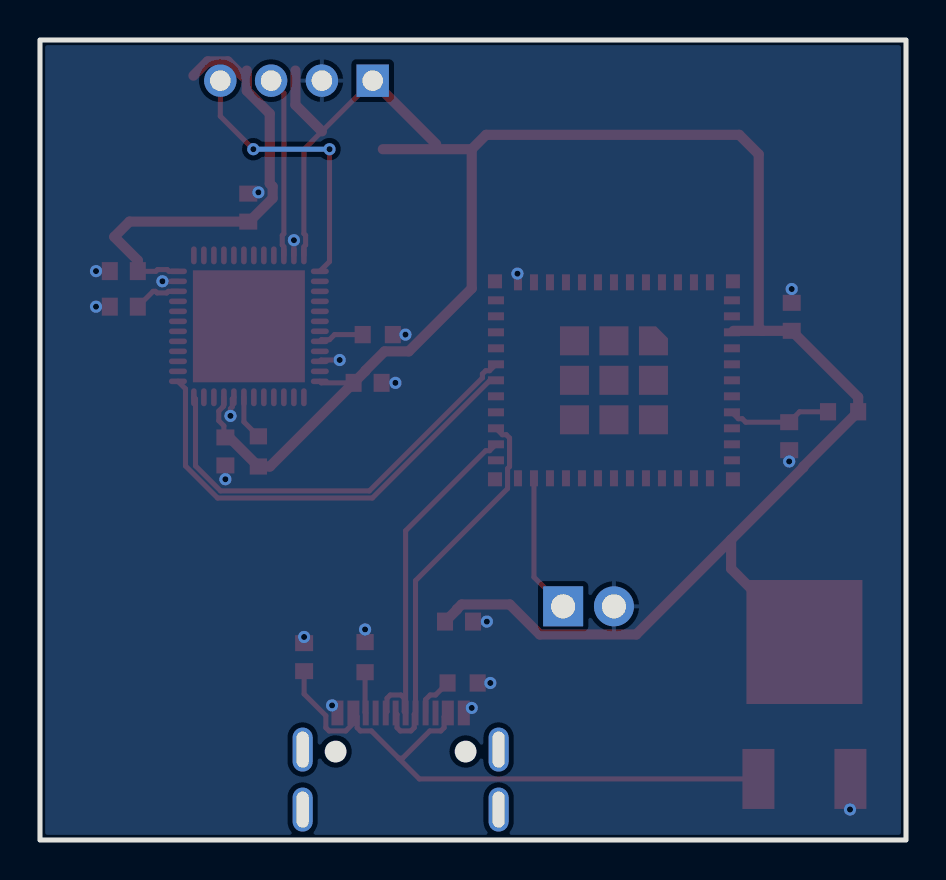
[diagram p8: board, bottom side, seen from below]

Outline 43.31 x 40.01 mm; copper layers: Top Layer, Bottom Layer. Coordinates in mm from the lower left corner of the outline.
Outline path: rectangle 0,40.01 43.31,0
Stack: Top Layer 0.035mm / Dielectric1 1.51mm FR4 er 4.5 / Bottom Layer 0.035mm

## Design rules (mm)
template: Custom Config
spacing copperThickness1oz (default): track to track 0.102, other pairs 0.152 to 0.3
spacing copperThickness2oz: track to track 0.203, other pairs 0.152 to 0.3
track width copperThickness1oz (default): min 0.127, default 0.254, max 2.54
track width copperThickness2oz: min 0.203, default 0.254, max 2.54
track width PWR: min 0.127, default 0.508, max 2.54
differential pair differentialPair (default): width min 0.127, default 0.254, max 2.54; gap min 0.152, default 0.152
via viaSize (default): diameter min 0.5, default 0.61, max 10; hole min 0.3, default 0.305, max 6.3
net 3V3 uses PWR

## Placement (name value [footprint] x y rotation side)
BOOT  PZ254V-11-02P  [HDR-TH_2P-P2.54-V-M]  15.88 11.68 180 top
C1  100nF  [C0603]  39.12 28.45 0 top
C2  100nF  [C0603]  26.92 22.86 180 top
C3  100nF  [C0603]  32.89 31.62 90 top
C4  100nF  [C0603]  34.04 19.43 270 top
C5  2.2uF  [C0603]  39.12 26.67 0 top
C6  1uF  [C0603]  5.84 20.19 270 top
C7  10uF  [C0603]  5.72 26.16 90 top
C8  10uF  [C0603]  30.1 9.14 90 top
C9  22uF  [C0603]  22.35 10.92 180 top
ESP_PROG  HX USB3.1TYPE-C-16P FS  [USB-C-SMD_HX-USB3.1TYPE-C-16P-FS]  25.27 3.94 0 top
R2  10K  [R0603]  32.38 19.43 270 top
R3  10K  [R0603]  26.42 25.27 0 top
R4  10K  [R0603]  3.15 21.41 0 top
R5  5.1K  [R0603]  27.05 9.14 270 top
R6  5.1K  [R0603]  22.17 7.85 0 top
SWD  SWD  [HDR-TH_4P-HX-PH254-01-04-Z-L11.5]  30.48 37.97 0 top
U1  STM32F410CBU6  [UFQFPN-48_L7.0-W7.0-P0.50-BL-EP5.6]  32.86 25.69 0 top
U2  ESP32-C3-MINI-1-N4  [WIFIM-SMD_ESP32-C3-MINI-1]  14.6 22.99 0 top
U3  AMS1117-3.3  [TO-252-2_L6.6-W5.6-P2.3-LS9.7]  5.08 6.48 270 top

## Footprints (pads in the part's own frame, mm; a bottom-side part is the same pattern mirrored in y, then rotated)
C0603
  rect 0.8x0.9 smd: 1(-0.7,0) 2(0.7,0)
HDR-TH_2P-P2.54-V-M
  rect 2x2 hole 1.2: 1(-1.27,0)
  round 2 hole 1.2: 2(1.27,0)
HDR-TH_4P-HX-PH254-01-04-Z-L11.5
  rect 1.62x1.62 hole 1.02: 1(-3.81,0)
  round 1.62 hole 1.02: 2(-1.27,0) 3(1.27,0) 4(3.81,0)
R0603
  rect 0.806x0.864 smd: 1(-0.753,0) 2(0.753,0)
TO-252-2_L6.6-W5.6-P2.3-LS9.7
  rect 3x1.6 smd: 1(3.423,-2.3) 3(3.424,2.3)
  rect 6.2x5.8 smd: 2(-3.424,0)
UFQFPN-48_L7.0-W7.0-P0.50-BL-EP5.6
  oval 0.28x0.9 smd: 1(-2.751,-3.547) 2(-2.251,-3.547) 3(-1.75,-3.547) 4(-1.25,-3.547) 5(-0.75,-3.547) 6(-0.249,-3.547) 7(0.249,-3.547) 8(0.75,-3.547) 9(1.25,-3.547) 10(1.75,-3.547) 11(2.251,-3.547) 12(2.751,-3.547) 25(2.751,3.547) 26(2.251,3.547) 27(1.75,3.547) 28(1.25,3.547) 29(0.75,3.547) 30(0.249,3.547) 31(-0.249,3.547) 32(-0.75,3.547) 33(-1.25,3.547) 34(-1.75,3.547) 35(-2.251,3.547) 36(-2.751,3.547)
  oval 0.9x0.28 smd: 13(3.547,-2.75) 14(3.547,-2.25) 15(3.547,-1.75) 16(3.547,-1.25) 17(3.547,-0.75) 18(3.547,-0.25) 19(3.547,0.25) 20(3.547,0.75) 21(3.547,1.25) 22(3.547,1.75) 23(3.547,2.25) 24(3.547,2.75) 37(-3.547,2.751) 38(-3.547,2.251) 39(-3.547,1.75) 40(-3.547,1.25) 41(-3.547,0.75) 42(-3.547,0.249) 43(-3.547,-0.249) 44(-3.547,-0.75) 45(-3.547,-1.25) 46(-3.547,-1.75) 47(-3.547,-2.251) 48(-3.547,-2.751)
  rect 5.6x5.6 smd: 49(0,0)
USB-C-SMD_HX-USB3.1TYPE-C-16P-FS
  oval 1x2.2 hole 0.6x1.8: 13(-4.9,0.585) 14(-4.9,-2.415) 15(4.9,-2.415) 16(4.9,0.585)
  rect 0.6x1.24 smd: A1B12(-3.16,2.415) A4B9(-2.36,2.415) B1A12(3.16,2.415) B4A9(2.36,2.415)
  rect 0.3x1.24 smd: A5(-1.25,2.415) A6(-0.25,2.415) A7(0.25,2.415) A8(1.25,2.415) B5(1.745,2.415) B6(0.745,2.415) B7(-0.745,2.415) B8(-1.745,2.415)
WIFIM-SMD_ESP32-C3-MINI-1
  rect 0.8x0.4 smd: 1(-5.9,4) 2(-5.9,3.2) 3(-5.9,2.4) 4(-5.9,1.6) 5(-5.9,0.8) 6(-5.9,0) 7(-5.9,-0.8) 8(-5.9,-1.6) 9(-5.9,-2.4) 10(-5.9,-3.2) 11(-5.9,-4) 25(5.9,-4) 26(5.9,-3.2) 27(5.9,-2.4) 28(5.9,-1.6) 29(5.9,-0.8) 30(5.9,0) 31(5.9,0.8) 32(5.9,1.6) 33(5.9,2.4) 34(5.9,3.2) 35(5.9,4)
  rect 0.4x0.8 smd: 12(-4.8,-4.9) 13(-4,-4.9) 14(-3.2,-4.9) 15(-2.4,-4.9) 16(-1.6,-4.9) 17(-0.8,-4.9) 18(0,-4.9) 19(0.8,-4.9) 20(1.6,-4.9) 21(2.4,-4.9) 22(3.2,-4.9) 23(4,-4.9) 24(4.8,-4.9) 36(4.8,4.9) 37(4,4.9) 38(3.2,4.9) 39(2.4,4.9) 40(1.6,4.9) 41(0.8,4.9) 42(0,4.9) 43(-0.8,4.9) 44(-1.6,4.9) 45(-2.4,4.9) 46(-3.2,4.9) 47(-4,4.9) 48(-4.8,4.9)
  custom 1.45x1.45 smd: 49(-1.975,1.975)
  rect 1.45x1.45 smd: 49(-1.975,0) 49(-1.975,-1.975) 49(0,1.975) 49(0,0) 49(0,-1.975) 49(1.975,1.975) 49(1.975,0) 49(1.975,-1.975)
  rect 0.7x0.7 smd: 50(5.95,4.95) 51(5.95,-4.95) 52(-5.95,-4.95) 53(-5.95,4.95)

## Nets
3V3: C1.1 C2.1 C3.1 C4.1 C7.1 C9.1 R2.2 R4.1 SWD.1 U1.9 U1.24 U1.36 U1.48 U2.3 U3.2
GND: BOOT.2 C1.2 C2.2 C3.2 C4.2 C5.2 C6.2 C7.2 C8.2 C9.2 ESP_PROG.A1B12 ESP_PROG.B1A12 R3.1 R5.1 R6.1 SWD.2 U1.8 U1.23 U1.35 U1.46 U2.36 U3.1
$1N1102: R3.2 U1.44
$1N1108: C5.1 U1.22
$1N2104: SWD.4 U1.37
$1N2110: SWD.3 U1.34
$1N2329: R2.1 U1.7
$1N3000: C6.1 R4.2 U2.8
$1N3531: ESP_PROG.A7 ESP_PROG.B7 U2.27
$1N3554: ESP_PROG.B5 R5.2
$1N3659: ESP_PROG.A5 R6.2
$1N3874: U1.12 U2.31
$1N3920: ESP_PROG.A6 ESP_PROG.B6 U2.26
$1N3927: U1.13 U2.30
$1N4055: BOOT.1 U2.23
$1N4702: C8.1 ESP_PROG.A4B9 ESP_PROG.B4A9 U3.3

Pads without a net: ESP_PROG 13 14 15 16 A8 B8; U1 1 2 3 4 5 6 10 11 14 15 16 17 18 19 20 21 25 26 27 28 29 30 31 32 33 38 39 40 41 42 43 45 47 49; U2 1 2 4 5 6 7 9 10 11 12 13 14 15 16 17 18 19 20 21 22 24 25 28 29 32 33 34 35 37 38 39 40 41 42 43 44 45 46 47 48 49 50 51 52 53

## Via types
v1: diameter 0.61, hole 0.305, Top Layer to Bottom Layer, 22 vias

## Routing (per net, layer and track width the routed paths; a pad name or vN(x,y) marks a point on that pad's centre or on a via; arc(x,y) is an arc through that point)
3V3: length 138.6
  Top Layer w0.254: 30.11,29.23 30.11,29.67 30.02,29.75 30.02,30.24 30.11,30.32 30.11,34.53 SWD.1 ; 29.31,22.94 29.24,22.86 C2.1 ; C1.1 38.41,28.44 37.51,28.44 37.43,28.52 36.94,28.52 36.86,28.44 U1.24 ; U1.9 34.11,21.74 34.14,21.71 34.14,21.68 34.37,21.45 34.37,20.97 34.11,20.71 34.11,20.21 34.04,20.13 ; 8.63,25.46 8.7,25.39
  Top Layer w0.508: 29.21,35.43 30.53,36.76 30.53,38.48 ; 21.72,34.54 21.72,27.58 24.86,24.44 26.07,24.44 27.03,23.48 27.03,23.45 C2.1 31.81,18.68 R2.2 33.84,20.13 34.04,20.13 ; 21.72,34.54 21,35.26 8.34,35.26 7.37,34.29 7.37,25.65 7.18,25.46 ; 21.72,34.54 26.16,34.54 ; 8.75,15.02 5.13,18.64 5.13,18.68 R4.1 2.39,22.14 C7.1 7.18,25.46 ; 8.75,15.02 13.49,10.28 18.31,10.28 19.81,11.78 22.22,11.78 22.46,11.54 22.46,11.52 C9.1 ; 8.75,15.02 8.75,13.57 U3.2 ; C1.1 38.42,28.98 39.59,30.16 38.83,30.92 C3.1 32.84,30.92 31.67,32.09 31.67,32.68 31.82,32.82 31.82,36.32 32.97,37.47 32.97,38.48 ; 7.18,25.46 8.63,25.46 ; 33.2,38.22 33.91,38.94 34.92,38.94 35.63,38.22 ; SWD.1 23.5,34.8
GND: length 3.6
  Top Layer w0.254: v1(37.19,27.94) 37.18,27.94 U1.23 ; U1.8 33.69,22.06 33.69,21.66 33.78,21.57 v1(33.78,21.21) ; U1.35 30.61,29.99 v1(30.61,29.99) ; U1.46 29.25,24 v1(28.32,24)
  vias: v1(2.8,1.52) v1(5.72,27.55) v1(5.84,18.93) v1(19.43,28.32) v1(20.79,7.85) v1(20.96,10.92) v1(21.72,6.6) v1(25.03,25.27) v1(25.53,22.86) v1(27.05,10.53) v1(28.7,6.73) v1(30.1,10.15) v1(32.38,32.39) v1(34.04,18.04) v1(40.51,28.45) v1(40.51,26.67)
$1N1102: length 2.3
  Top Layer w0.254: U1.44 29.23,25.02 28.83,25.02 28.58,25.27 R3.2
$1N1108: length 2.4
  Top Layer w0.254: C5.1 37.65,27.44 37.53,27.44 37.45,27.36 36.97,27.36 36.89,27.44 U1.22
$1N2104: length 14.2
  Top Layer w0.254: v1(28.83,34.54) 28.83,28.92 U1.37 ; SWD.4 34.29,36.2 v1(32.64,34.54)
  Bottom Layer w0.254: v1(32.64,34.54) v1(28.83,34.54)
$1N2110: length 9.1
  Top Layer w0.254: SWD.3 31.11,37.33 31.11,30.32 31.19,30.24 31.19,29.75 31.11,29.67 U1.34
$1N2329: length 2.3
  Top Layer w0.254: R2.1 33.11,20.91 U1.7
$1N3000: length 5.2
  Top Layer w0.254: 8.7,21.39 8.38,21.07 8.19,21.07 8.02,20.89 C6.1 5.32,21.41 R4.2
$1N3531: length 19.1
  Top Layer w0.254: U2.27 20.18,20.27 19.99,20.27 19.83,20.1 19.83,18.67 19.93,18.57 19.93,17.57 24.53,12.97 ESP_PROG.B7 24.59,6.29 24.59,5.62 24.76,5.45 25.29,5.45 25.45,5.62 25.45,6.28 ESP_PROG.A7
$1N3554: length 2.1
  Top Layer w0.254: R5.2 27.05,6.39 ESP_PROG.B5
$1N3659: length 2.1
  Top Layer w0.254: ESP_PROG.A5 24.02,7.02 23.79,7.25 23.53,7.25 22.93,7.85
$1N3874: length 21.7
  Top Layer w0.254: U2.31 20.83,23.47 21.02,23.47 21.18,23.3 21.18,23.11 26.84,17.46 34.28,17.46 35.53,18.71 35.53,22.06 U1.12
$1N3920: length 17.9
  Top Layer w0.254: U2.26 20.83,19.47 21.02,19.47 25.02,15.46 ESP_PROG.A6 25.09,6.42 25.09,7.09 25.26,7.25 25.79,7.25 25.95,7.09 25.95,6.42 ESP_PROG.B6
$1N3927: length 23
  Top Layer w0.254: U1.13 36.03,22.56 36.03,18.71 34.42,17.1 26.69,17.1 20.8,22.99 U2.30
$1N4055: length 7
  Top Layer w0.254: BOOT.1 18.6,13.14 U2.23
$1N4702: length 31.1
  Top Layer w0.254: 25.38,4.1 26.73,5.45 27.28,5.45 27.45,5.62 27.45,6.17 ESP_PROG.B4A9 27.63,5.84 28.02,5.45 28.85,5.45 29.01,5.62 29.01,6.22 30.1,7.3 C8.1 ; 25.38,4.1 24.33,3.05 7.38,3.05 ; 25.38,4.1 25.17,4.1 23.81,5.45 23.26,5.45 23.1,5.62 23.1,6.17 ESP_PROG.A4B9

## Copper pours and planes (outline as drawn; the poured copper is in the pictures)
GND on Bottom Layer: 0,40.01 43.31,40.01 43.31,-0.13 0,-0.13

# Board PCB3
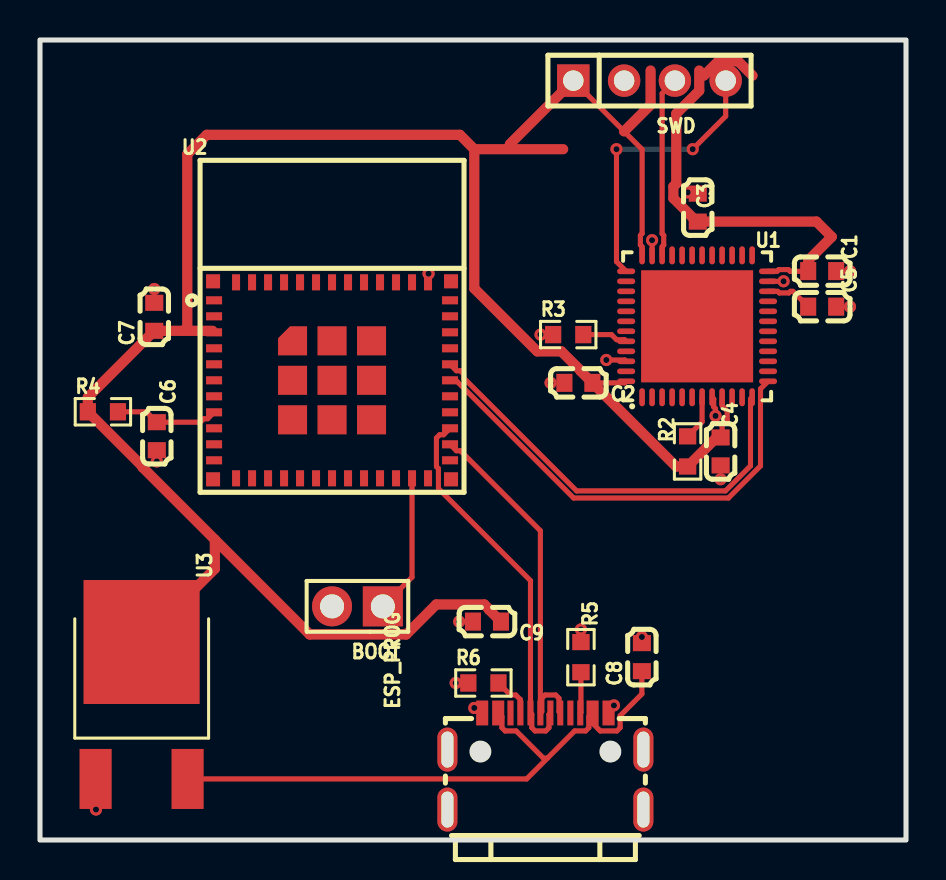
[diagram p9: board, top side]
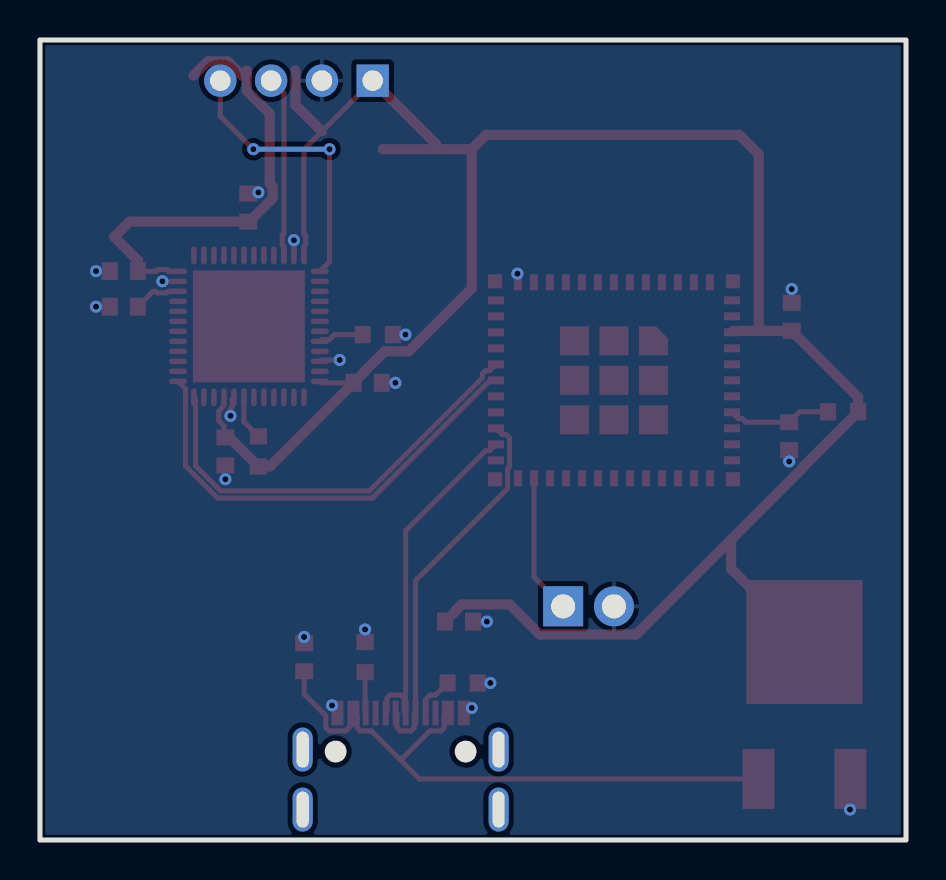
[diagram p10: board, bottom side, seen from below]

Outline 43.31 x 40.01 mm; copper layers: Top Layer, Bottom Layer. Coordinates in mm from the lower left corner of the outline.
Outline path: rectangle 0,40.01 43.31,0
Stack: Top Layer 0.035mm / Dielectric1 1.51mm FR4 er 4.5 / Bottom Layer 0.035mm

## Design rules (mm)
template: Custom Config
spacing copperThickness1oz (default): track to track 0.102, other pairs 0.152 to 0.3
spacing copperThickness2oz: track to track 0.203, other pairs 0.152 to 0.3
track width copperThickness1oz (default): min 0.127, default 0.254, max 2.54
track width copperThickness2oz: min 0.203, default 0.254, max 2.54
track width PWR: min 0.127, default 0.508, max 2.54
differential pair differentialPair (default): width min 0.127, default 0.254, max 2.54; gap min 0.152, default 0.152
via viaSize (default): diameter min 0.5, default 0.61, max 10; hole min 0.3, default 0.305, max 6.3
net 3V3 uses PWR

## Placement (name value [footprint] x y rotation side)
BOOT  PZ254V-11-02P  [HDR-TH_2P-P2.54-V-M]  15.88 11.68 180 top
C1  100nF  [C0603]  39.12 28.45 0 top
C2  100nF  [C0603]  26.92 22.86 180 top
C3  100nF  [C0603]  32.89 31.62 90 top
C4  100nF  [C0603]  34.04 19.43 270 top
C5  2.2uF  [C0603]  39.12 26.67 0 top
C6  1uF  [C0603]  5.84 20.19 270 top
C7  10uF  [C0603]  5.72 26.16 90 top
C8  10uF  [C0603]  30.1 9.14 90 top
C9  22uF  [C0603]  22.35 10.92 180 top
ESP_PROG  HX USB3.1TYPE-C-16P FS  [USB-C-SMD_HX-USB3.1TYPE-C-16P-FS]  25.27 3.94 0 top
R2  5.1K  [R0603]  32.38 19.43 270 top
R3  10K  [R0603]  26.42 25.27 0 top
R4  10K  [R0603]  3.15 21.41 0 top
R5  5.1K  [R0603]  27.05 9.14 270 top
R6  5.1K  [R0603]  22.17 7.85 0 top
SWD  SWD  [HDR-TH_4P-HX-PH254-01-04-Z-L11.5]  30.48 37.97 0 top
U1  STM32F410CBU6  [UFQFPN-48_L7.0-W7.0-P0.50-BL-EP5.6]  32.86 25.69 0 top
U2  ESP32-C3-MINI-1-N4  [WIFIM-SMD_ESP32-C3-MINI-1]  14.6 22.99 0 top
U3  AMS1117-3.3  [TO-252-2_L6.6-W5.6-P2.3-LS9.7]  5.08 6.48 270 top

## Footprints (pads in the part's own frame, mm; a bottom-side part is the same pattern mirrored in y, then rotated)
C0603
  rect 0.8x0.9 smd: 1(-0.7,0) 2(0.7,0)
HDR-TH_2P-P2.54-V-M
  rect 2x2 hole 1.2: 1(-1.27,0)
  round 2 hole 1.2: 2(1.27,0)
HDR-TH_4P-HX-PH254-01-04-Z-L11.5
  rect 1.62x1.62 hole 1.02: 1(-3.81,0)
  round 1.62 hole 1.02: 2(-1.27,0) 3(1.27,0) 4(3.81,0)
R0603
  rect 0.806x0.864 smd: 1(-0.753,0) 2(0.753,0)
TO-252-2_L6.6-W5.6-P2.3-LS9.7
  rect 3x1.6 smd: 1(3.423,-2.3) 3(3.424,2.3)
  rect 6.2x5.8 smd: 2(-3.424,0)
UFQFPN-48_L7.0-W7.0-P0.50-BL-EP5.6
  oval 0.28x0.9 smd: 1(-2.751,-3.547) 2(-2.251,-3.547) 3(-1.75,-3.547) 4(-1.25,-3.547) 5(-0.75,-3.547) 6(-0.249,-3.547) 7(0.249,-3.547) 8(0.75,-3.547) 9(1.25,-3.547) 10(1.75,-3.547) 11(2.251,-3.547) 12(2.751,-3.547) 25(2.751,3.547) 26(2.251,3.547) 27(1.75,3.547) 28(1.25,3.547) 29(0.75,3.547) 30(0.249,3.547) 31(-0.249,3.547) 32(-0.75,3.547) 33(-1.25,3.547) 34(-1.75,3.547) 35(-2.251,3.547) 36(-2.751,3.547)
  oval 0.9x0.28 smd: 13(3.547,-2.75) 14(3.547,-2.25) 15(3.547,-1.75) 16(3.547,-1.25) 17(3.547,-0.75) 18(3.547,-0.25) 19(3.547,0.25) 20(3.547,0.75) 21(3.547,1.25) 22(3.547,1.75) 23(3.547,2.25) 24(3.547,2.75) 37(-3.547,2.751) 38(-3.547,2.251) 39(-3.547,1.75) 40(-3.547,1.25) 41(-3.547,0.75) 42(-3.547,0.249) 43(-3.547,-0.249) 44(-3.547,-0.75) 45(-3.547,-1.25) 46(-3.547,-1.75) 47(-3.547,-2.251) 48(-3.547,-2.751)
  rect 5.6x5.6 smd: 49(0,0)
USB-C-SMD_HX-USB3.1TYPE-C-16P-FS
  oval 1x2.2 hole 0.6x1.8: 13(-4.9,0.585) 14(-4.9,-2.415) 15(4.9,-2.415) 16(4.9,0.585)
  rect 0.6x1.24 smd: A1B12(-3.16,2.415) A4B9(-2.36,2.415) B1A12(3.16,2.415) B4A9(2.36,2.415)
  rect 0.3x1.24 smd: A5(-1.25,2.415) A6(-0.25,2.415) A7(0.25,2.415) A8(1.25,2.415) B5(1.745,2.415) B6(0.745,2.415) B7(-0.745,2.415) B8(-1.745,2.415)
WIFIM-SMD_ESP32-C3-MINI-1
  rect 0.8x0.4 smd: 1(-5.9,4) 2(-5.9,3.2) 3(-5.9,2.4) 4(-5.9,1.6) 5(-5.9,0.8) 6(-5.9,0) 7(-5.9,-0.8) 8(-5.9,-1.6) 9(-5.9,-2.4) 10(-5.9,-3.2) 11(-5.9,-4) 25(5.9,-4) 26(5.9,-3.2) 27(5.9,-2.4) 28(5.9,-1.6) 29(5.9,-0.8) 30(5.9,0) 31(5.9,0.8) 32(5.9,1.6) 33(5.9,2.4) 34(5.9,3.2) 35(5.9,4)
  rect 0.4x0.8 smd: 12(-4.8,-4.9) 13(-4,-4.9) 14(-3.2,-4.9) 15(-2.4,-4.9) 16(-1.6,-4.9) 17(-0.8,-4.9) 18(0,-4.9) 19(0.8,-4.9) 20(1.6,-4.9) 21(2.4,-4.9) 22(3.2,-4.9) 23(4,-4.9) 24(4.8,-4.9) 36(4.8,4.9) 37(4,4.9) 38(3.2,4.9) 39(2.4,4.9) 40(1.6,4.9) 41(0.8,4.9) 42(0,4.9) 43(-0.8,4.9) 44(-1.6,4.9) 45(-2.4,4.9) 46(-3.2,4.9) 47(-4,4.9) 48(-4.8,4.9)
  custom 1.45x1.45 smd: 49(-1.975,1.975)
  rect 1.45x1.45 smd: 49(-1.975,0) 49(-1.975,-1.975) 49(0,1.975) 49(0,0) 49(0,-1.975) 49(1.975,1.975) 49(1.975,0) 49(1.975,-1.975)
  rect 0.7x0.7 smd: 50(5.95,4.95) 51(5.95,-4.95) 52(-5.95,-4.95) 53(-5.95,4.95)

## Nets
3V3: C1.1 C2.1 C3.1 C4.1 C7.1 C9.1 R2.2 R4.1 SWD.1 U1.9 U1.24 U1.36 U1.48 U2.3 U3.2
GND: BOOT.2 C1.2 C2.2 C3.2 C4.2 C5.2 C6.2 C7.2 C8.2 C9.2 ESP_PROG.A1B12 ESP_PROG.B1A12 R3.1 R5.1 R6.1 SWD.2 U1.8 U1.23 U1.35 U1.46 U2.36 U3.1
$1N1102: R3.2 U1.44
$1N1108: C5.1 U1.22
$1N2104: SWD.4 U1.37
$1N2110: SWD.3 U1.34
$1N2329: R2.1 U1.7
$1N3000: C6.1 R4.2 U2.8
$1N3531: ESP_PROG.A7 ESP_PROG.B7 U2.27
$1N3554: ESP_PROG.B5 R5.2
$1N3659: ESP_PROG.A5 R6.2
$1N3874: U1.12 U2.31
$1N3920: ESP_PROG.A6 ESP_PROG.B6 U2.26
$1N3927: U1.13 U2.30
$1N4055: BOOT.1 U2.23
$1N4702: C8.1 ESP_PROG.A4B9 ESP_PROG.B4A9 U3.3

Pads without a net: ESP_PROG 13 14 15 16 A8 B8; U1 1 2 3 4 5 6 10 11 14 15 16 17 18 19 20 21 25 26 27 28 29 30 31 32 33 38 39 40 41 42 43 45 47 49; U2 1 2 4 5 6 7 9 10 11 12 13 14 15 16 17 18 19 20 21 22 24 25 28 29 32 33 34 35 37 38 39 40 41 42 43 44 45 46 47 48 49 50 51 52 53

## Via types
v1: diameter 0.61, hole 0.305, Top Layer to Bottom Layer, 22 vias

## Routing (per net, layer and track width the routed paths; a pad name or vN(x,y) marks a point on that pad's centre or on a via; arc(x,y) is an arc through that point)
3V3: length 138.6
  Top Layer w0.254: C1.1 38.41,28.44 37.51,28.44 37.43,28.52 36.94,28.52 36.86,28.44 U1.24 ; SWD.1 30.11,34.53 30.11,30.32 30.02,30.24 30.02,29.75 30.11,29.67 30.11,29.23 ; 34.04,20.13 34.11,20.21 34.11,20.71 34.37,20.97 34.37,21.45 34.14,21.68 34.14,21.71 34.11,21.74 U1.9 ; C2.1 29.24,22.86 29.31,22.94 ; 8.63,25.46 8.7,25.39
  Top Layer w0.508: C9.1 22.46,11.52 22.46,11.54 22.22,11.78 19.81,11.78 18.31,10.28 13.49,10.28 8.75,15.02 ; 29.21,35.43 30.53,36.76 30.53,38.48 ; 7.18,25.46 C7.1 2.39,22.14 R4.1 5.13,18.68 5.13,18.64 8.75,15.02 ; 7.18,25.46 8.63,25.46 ; 7.18,25.46 7.37,25.65 7.37,34.29 8.34,35.26 21,35.26 21.72,34.54 ; 8.75,15.02 8.75,13.57 U3.2 ; C1.1 38.42,28.98 39.59,30.16 38.83,30.92 C3.1 32.84,30.92 31.67,32.09 31.67,32.68 31.82,32.82 31.82,36.32 32.97,37.47 32.97,38.48 ; 21.72,34.54 26.16,34.54 ; 21.72,34.54 21.72,27.58 24.86,24.44 26.07,24.44 27.03,23.48 27.03,23.45 C2.1 31.81,18.68 R2.2 33.84,20.13 34.04,20.13 ; 33.2,38.22 33.91,38.94 34.92,38.94 35.63,38.22 ; SWD.1 23.5,34.8
GND: length 3.6
  Top Layer w0.254: U1.35 30.61,29.99 v1(30.61,29.99) ; v1(37.19,27.94) 37.18,27.94 U1.23 ; v1(28.32,24) 29.25,24 U1.46 ; U1.8 33.69,22.06 33.69,21.66 33.78,21.57 v1(33.78,21.21)
  vias: v1(2.8,1.52) v1(5.72,27.55) v1(5.84,18.93) v1(19.43,28.32) v1(20.79,7.85) v1(20.96,10.92) v1(21.72,6.6) v1(25.03,25.27) v1(25.53,22.86) v1(27.05,10.53) v1(28.7,6.73) v1(30.1,10.15) v1(32.38,32.39) v1(34.04,18.04) v1(40.51,28.45) v1(40.51,26.67)
$1N1102: length 2.3
  Top Layer w0.254: U1.44 29.23,25.02 28.83,25.02 28.58,25.27 R3.2
$1N1108: length 2.4
  Top Layer w0.254: C5.1 37.65,27.44 37.53,27.44 37.45,27.36 36.97,27.36 36.89,27.44 U1.22
$1N2104: length 14.2
  Top Layer w0.254: v1(28.83,34.54) 28.83,28.92 U1.37 ; SWD.4 34.29,36.2 v1(32.64,34.54)
  Bottom Layer w0.254: v1(32.64,34.54) v1(28.83,34.54)
$1N2110: length 9.1
  Top Layer w0.254: U1.34 31.11,29.67 31.19,29.75 31.19,30.24 31.11,30.32 31.11,37.33 SWD.3
$1N2329: length 2.3
  Top Layer w0.254: R2.1 33.11,20.91 U1.7
$1N3000: length 5.2
  Top Layer w0.254: 8.7,21.39 8.38,21.07 8.19,21.07 8.02,20.89 C6.1 5.32,21.41 R4.2
$1N3531: length 19.1
  Top Layer w0.254: U2.27 20.18,20.27 19.99,20.27 19.83,20.1 19.83,18.67 19.93,18.57 19.93,17.57 24.53,12.97 ESP_PROG.B7 24.59,6.29 24.59,5.62 24.76,5.45 25.29,5.45 25.45,5.62 25.45,6.28 ESP_PROG.A7
$1N3554: length 2.1
  Top Layer w0.254: ESP_PROG.B5 27.05,6.39 R5.2
$1N3659: length 2.1
  Top Layer w0.254: 22.93,7.85 23.53,7.25 23.79,7.25 24.02,7.02 ESP_PROG.A5
$1N3874: length 21.7
  Top Layer w0.254: U2.31 20.83,23.47 21.02,23.47 21.18,23.3 21.18,23.11 26.84,17.46 34.28,17.46 35.53,18.71 35.53,22.06 U1.12
$1N3920: length 17.9
  Top Layer w0.254: ESP_PROG.B6 25.95,6.42 25.95,7.09 25.79,7.25 25.26,7.25 25.09,7.09 25.09,6.42 ESP_PROG.A6 25.02,15.46 21.02,19.47 20.83,19.47 U2.26
$1N3927: length 23
  Top Layer w0.254: U2.30 20.8,22.99 26.69,17.1 34.42,17.1 36.03,18.71 36.03,22.56 U1.13
$1N4055: length 7
  Top Layer w0.254: U2.23 18.6,13.14 BOOT.1
$1N4702: length 31.1
  Top Layer w0.254: 25.38,4.1 26.73,5.45 27.28,5.45 27.45,5.62 27.45,6.17 ESP_PROG.B4A9 27.63,5.84 28.02,5.45 28.85,5.45 29.01,5.62 29.01,6.22 30.1,7.3 C8.1 ; 25.38,4.1 25.17,4.1 23.81,5.45 23.26,5.45 23.1,5.62 23.1,6.17 ESP_PROG.A4B9 ; 25.38,4.1 24.33,3.05 7.38,3.05

## Copper pours and planes (outline as drawn; the poured copper is in the pictures)
GND on Bottom Layer: 0,40.01 43.31,40.01 43.31,-0.13 0,-0.13
